# EAGLE design S7G7_footprint_simplified_w_ethernet_v1p14 (EAGLE 9.5.2)
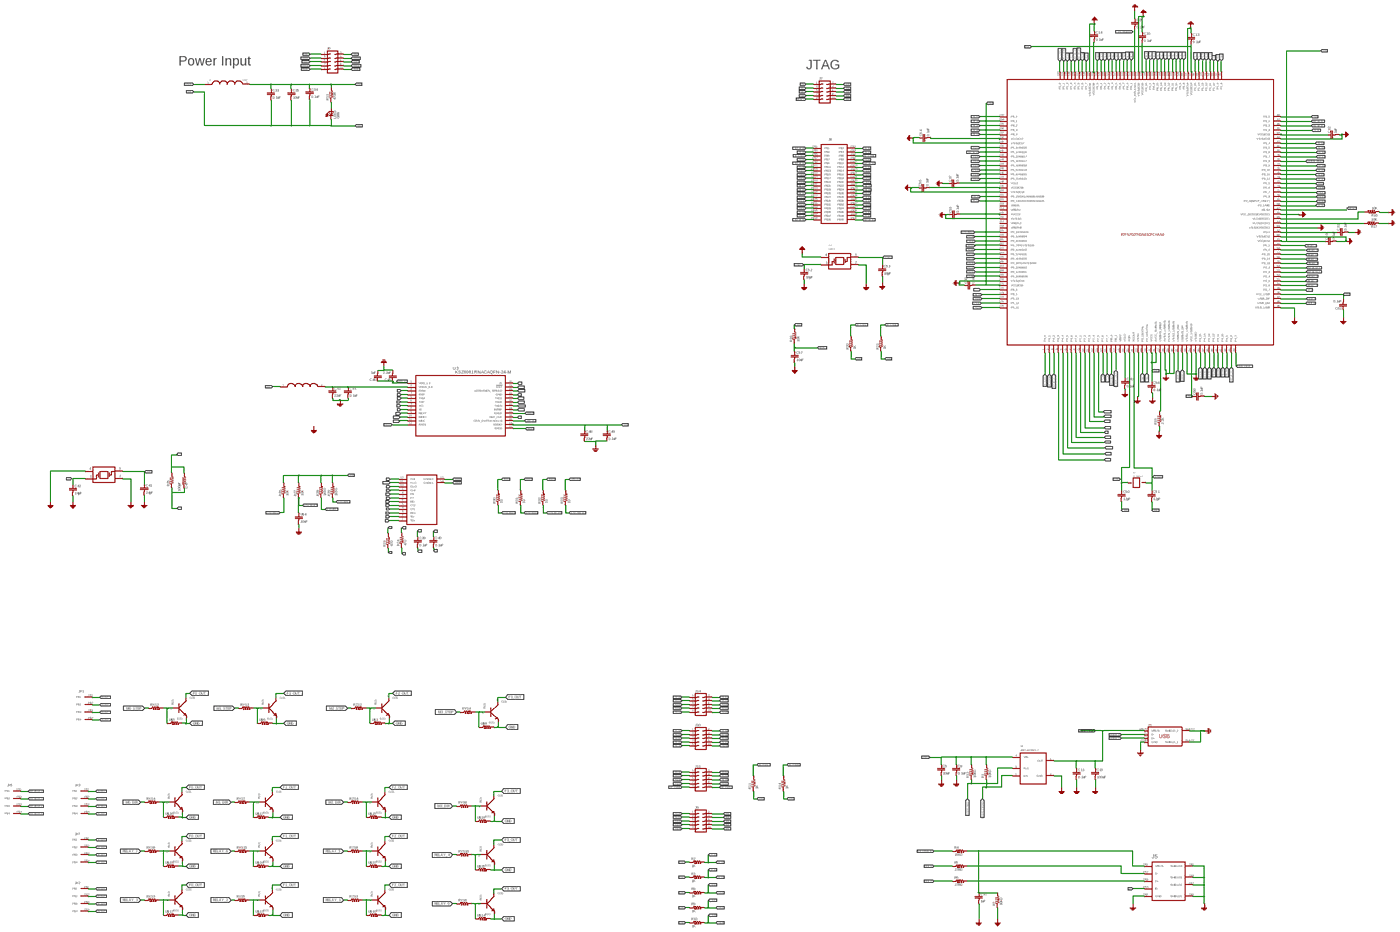
[diagram p0: schematic, sheet 1, overview]
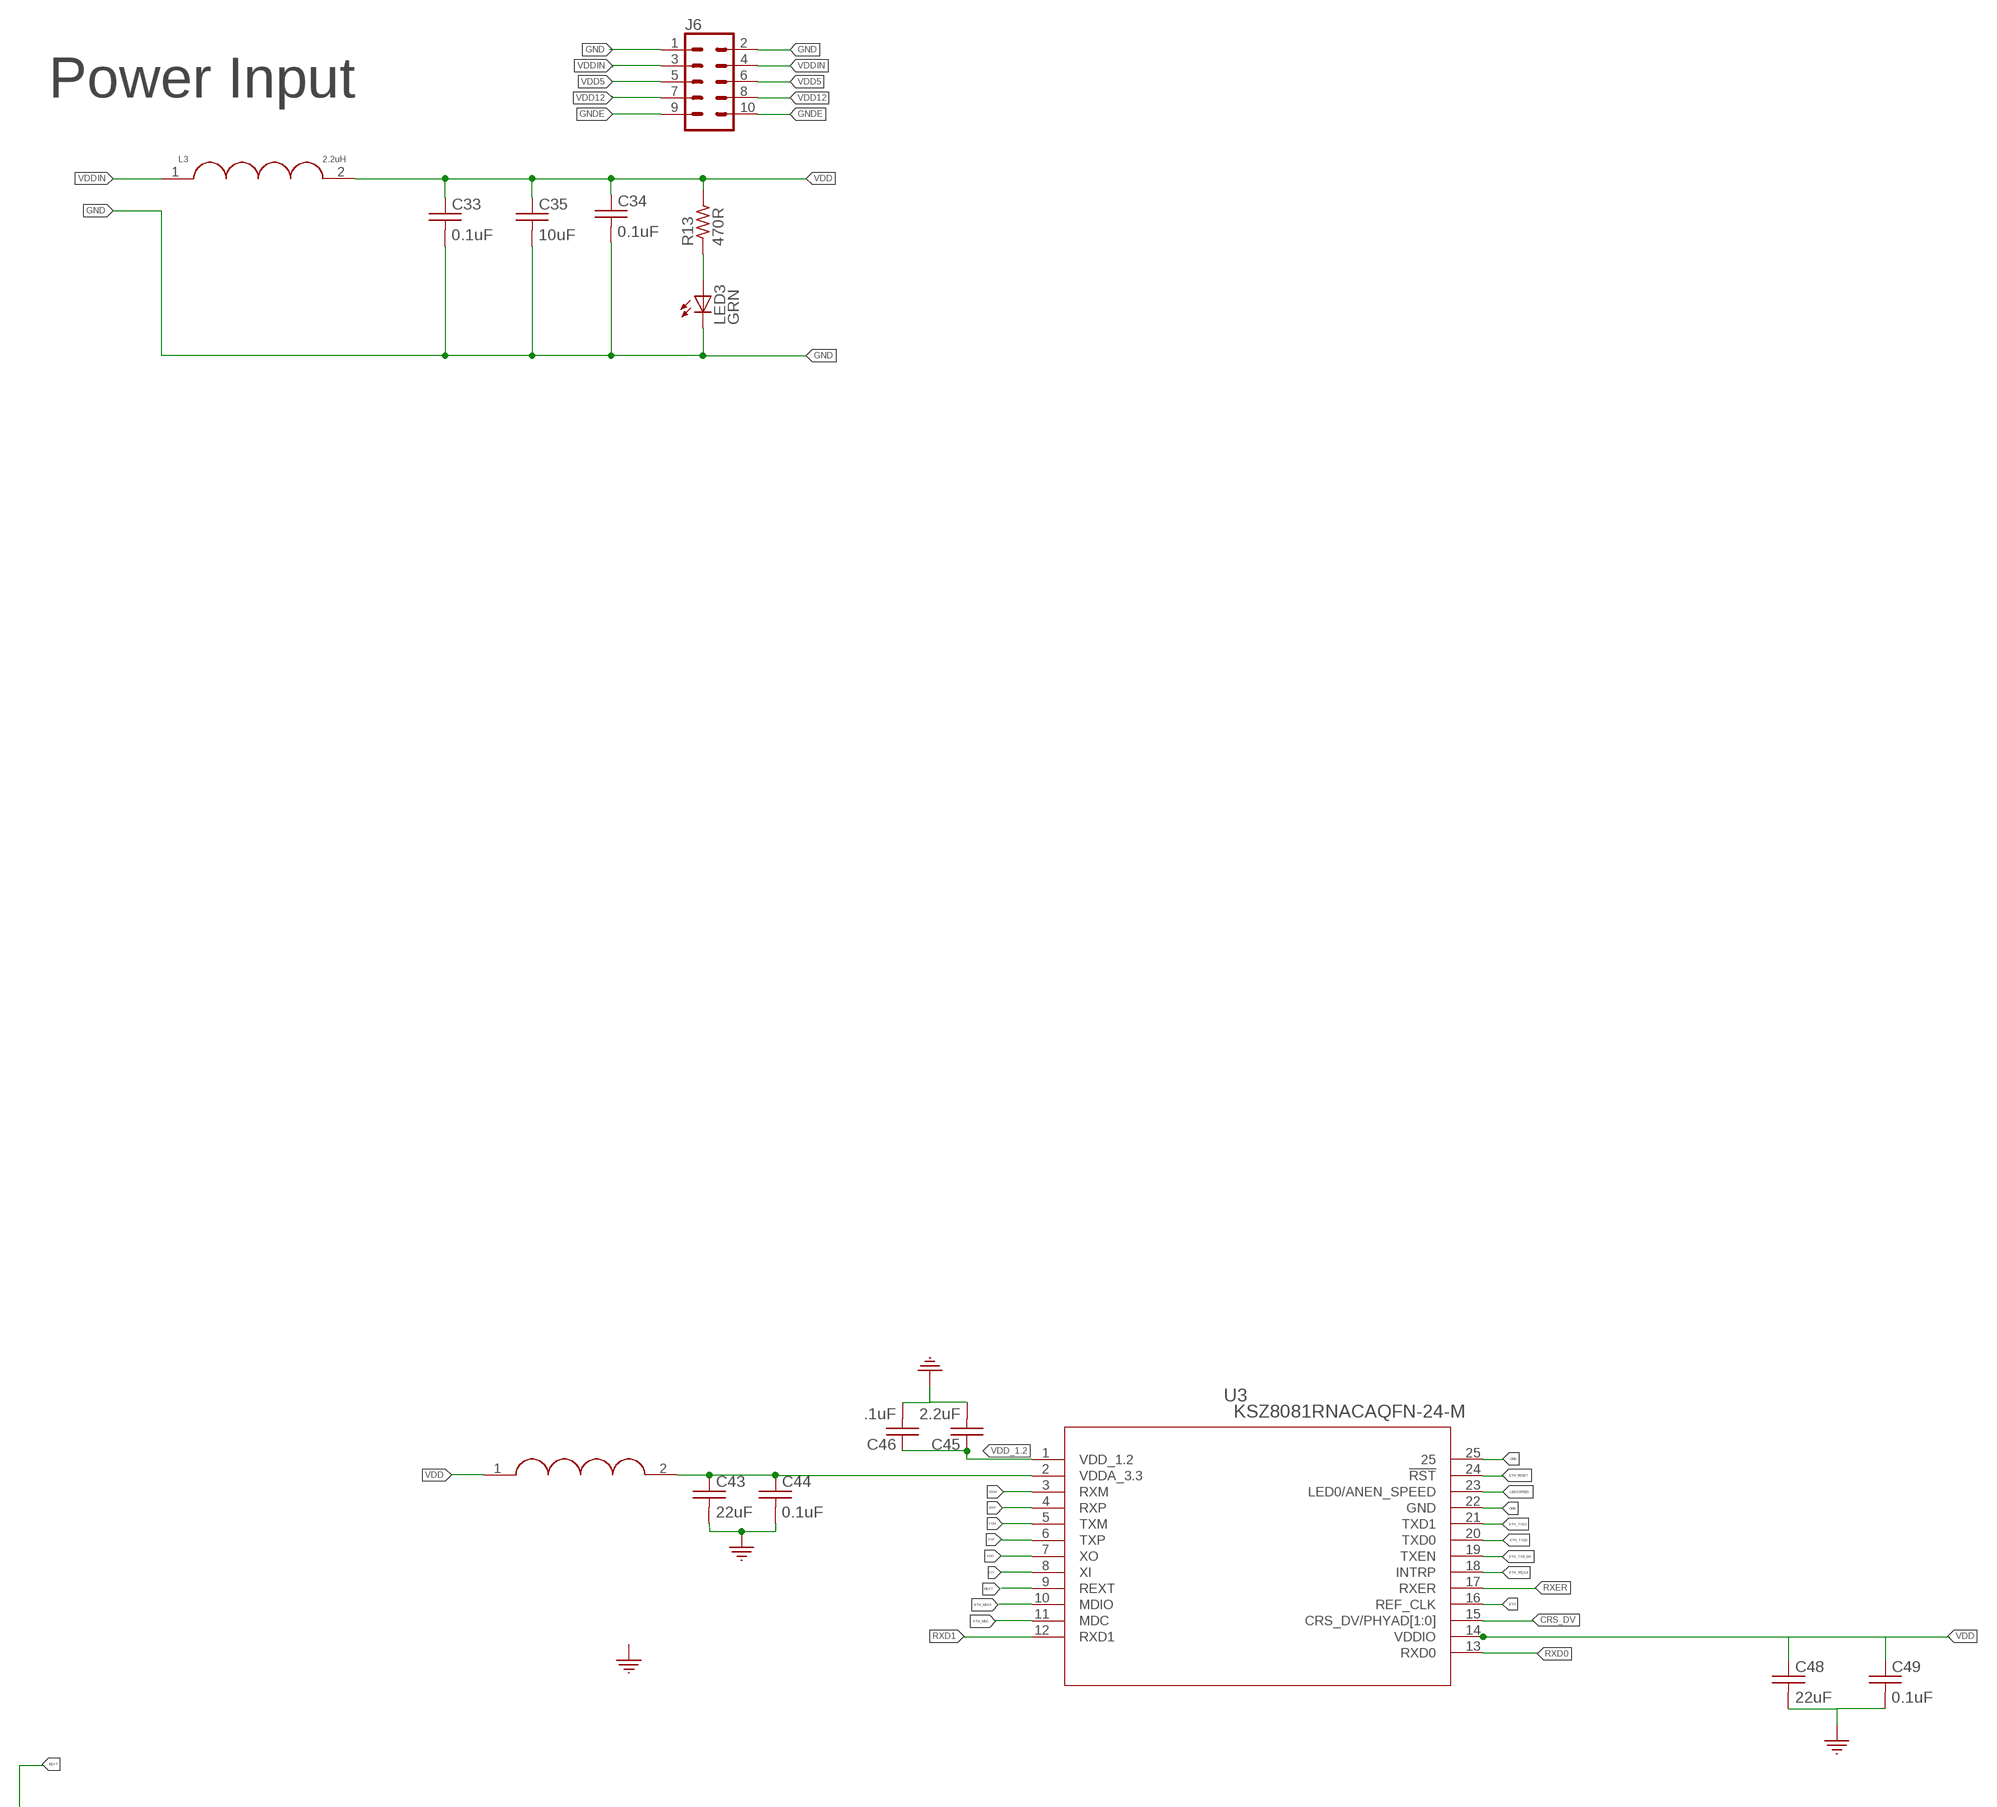
[diagram p1: schematic, sheet 1, part 1 of 4]
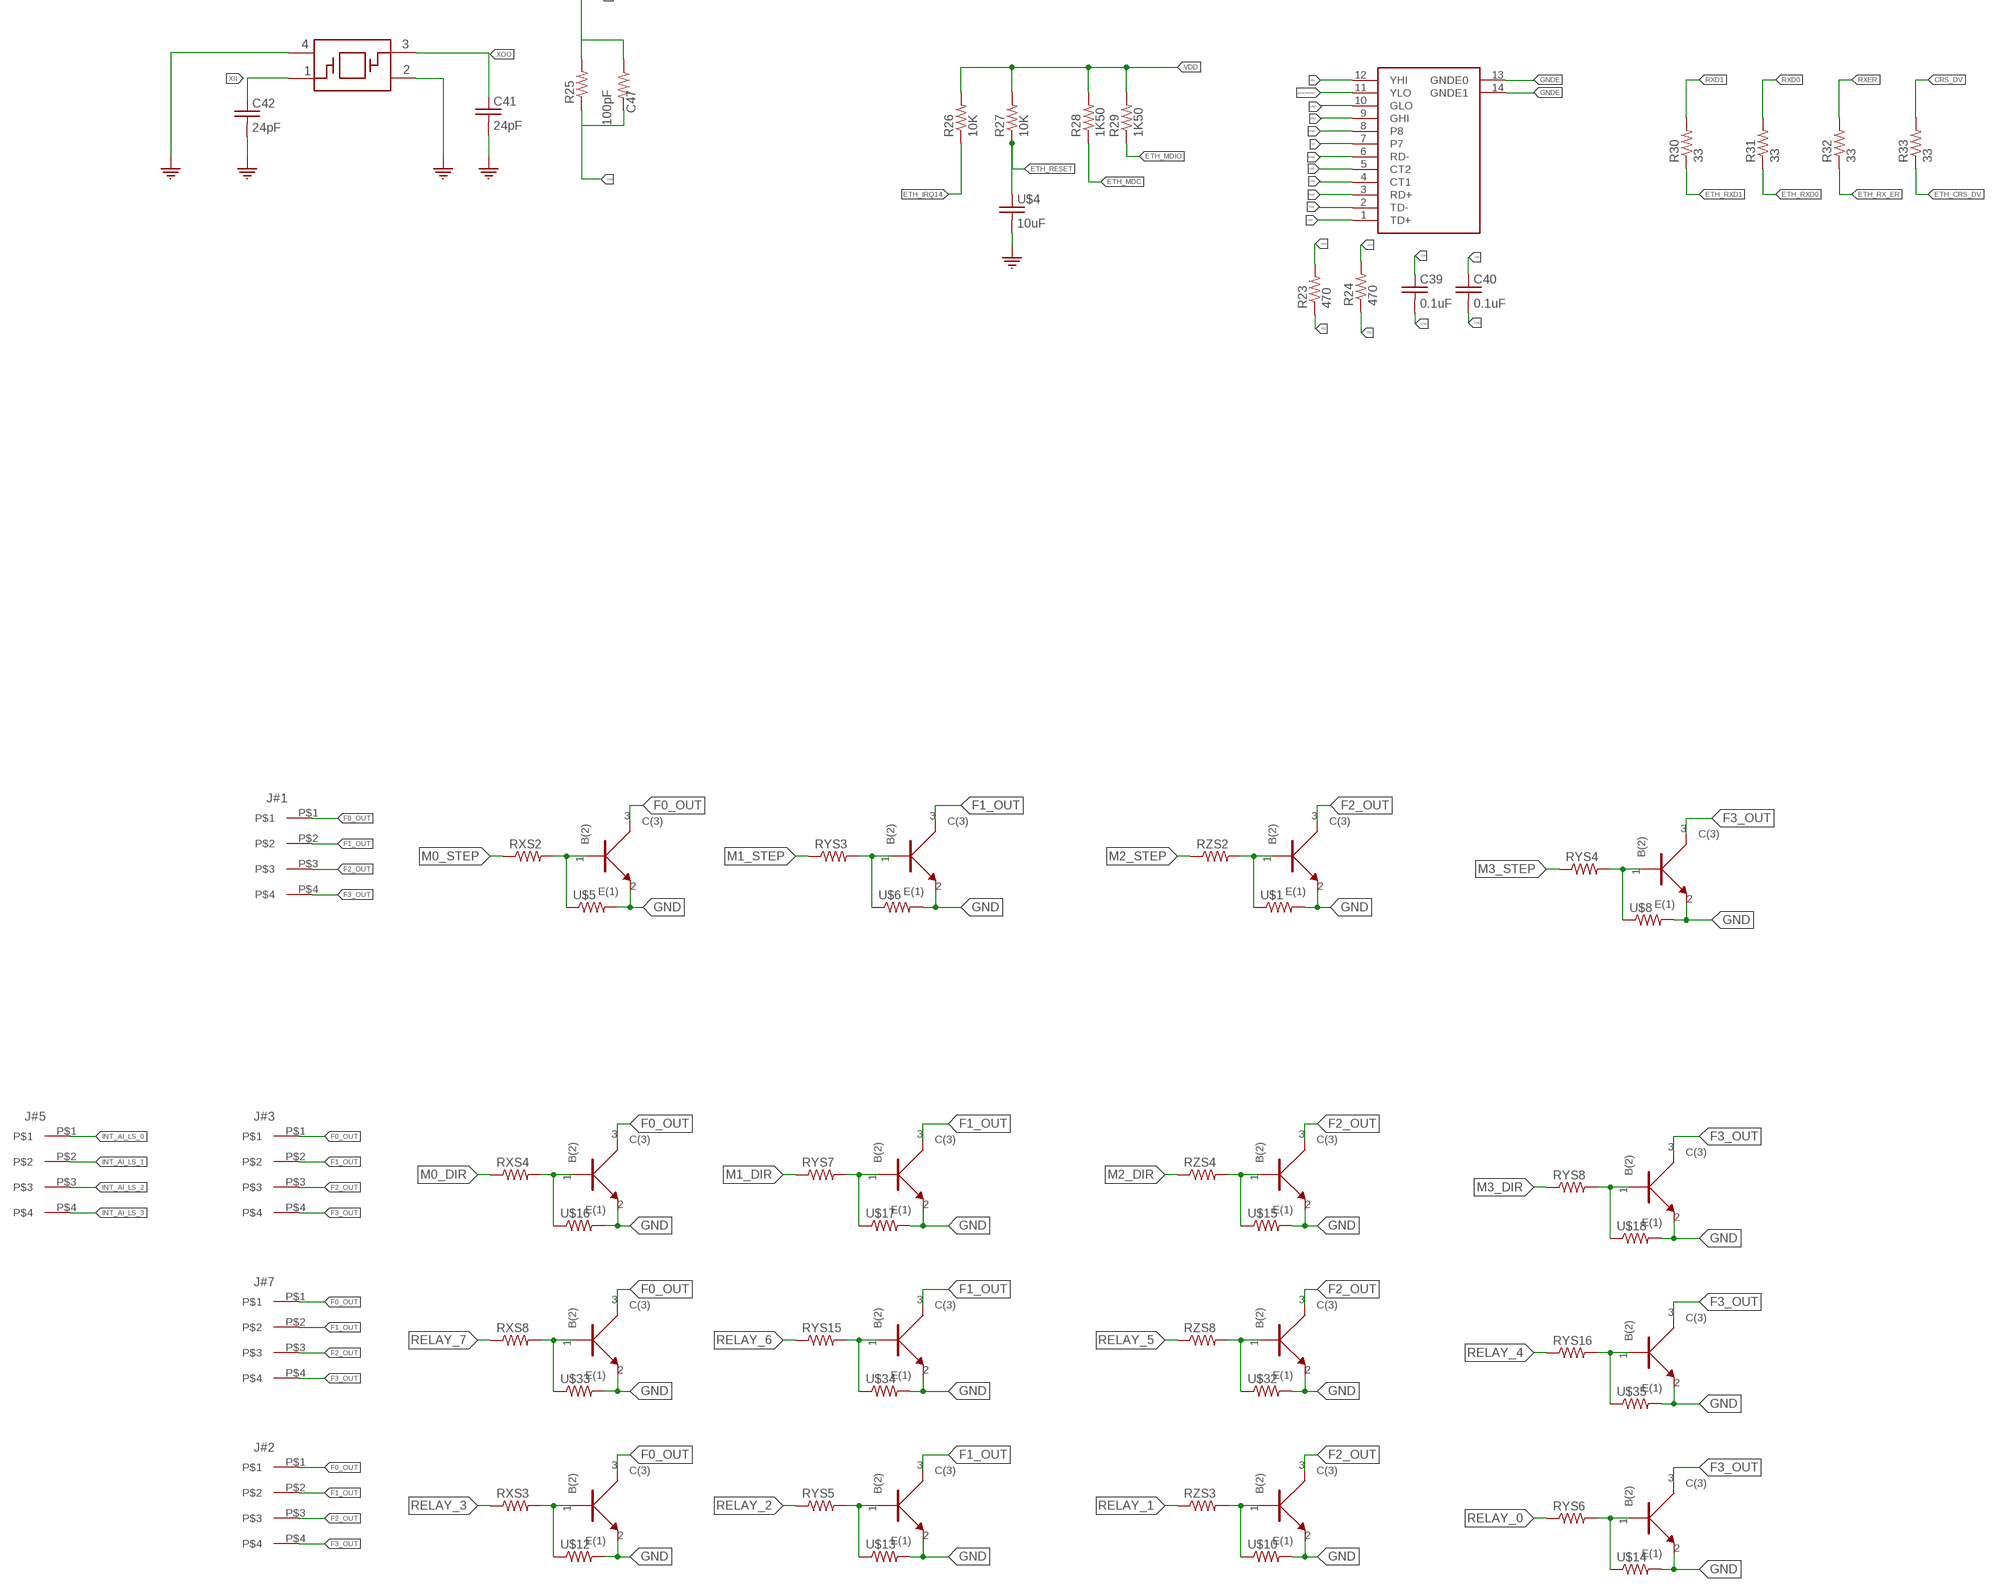
[diagram p2: schematic, sheet 1, part 2 of 4]
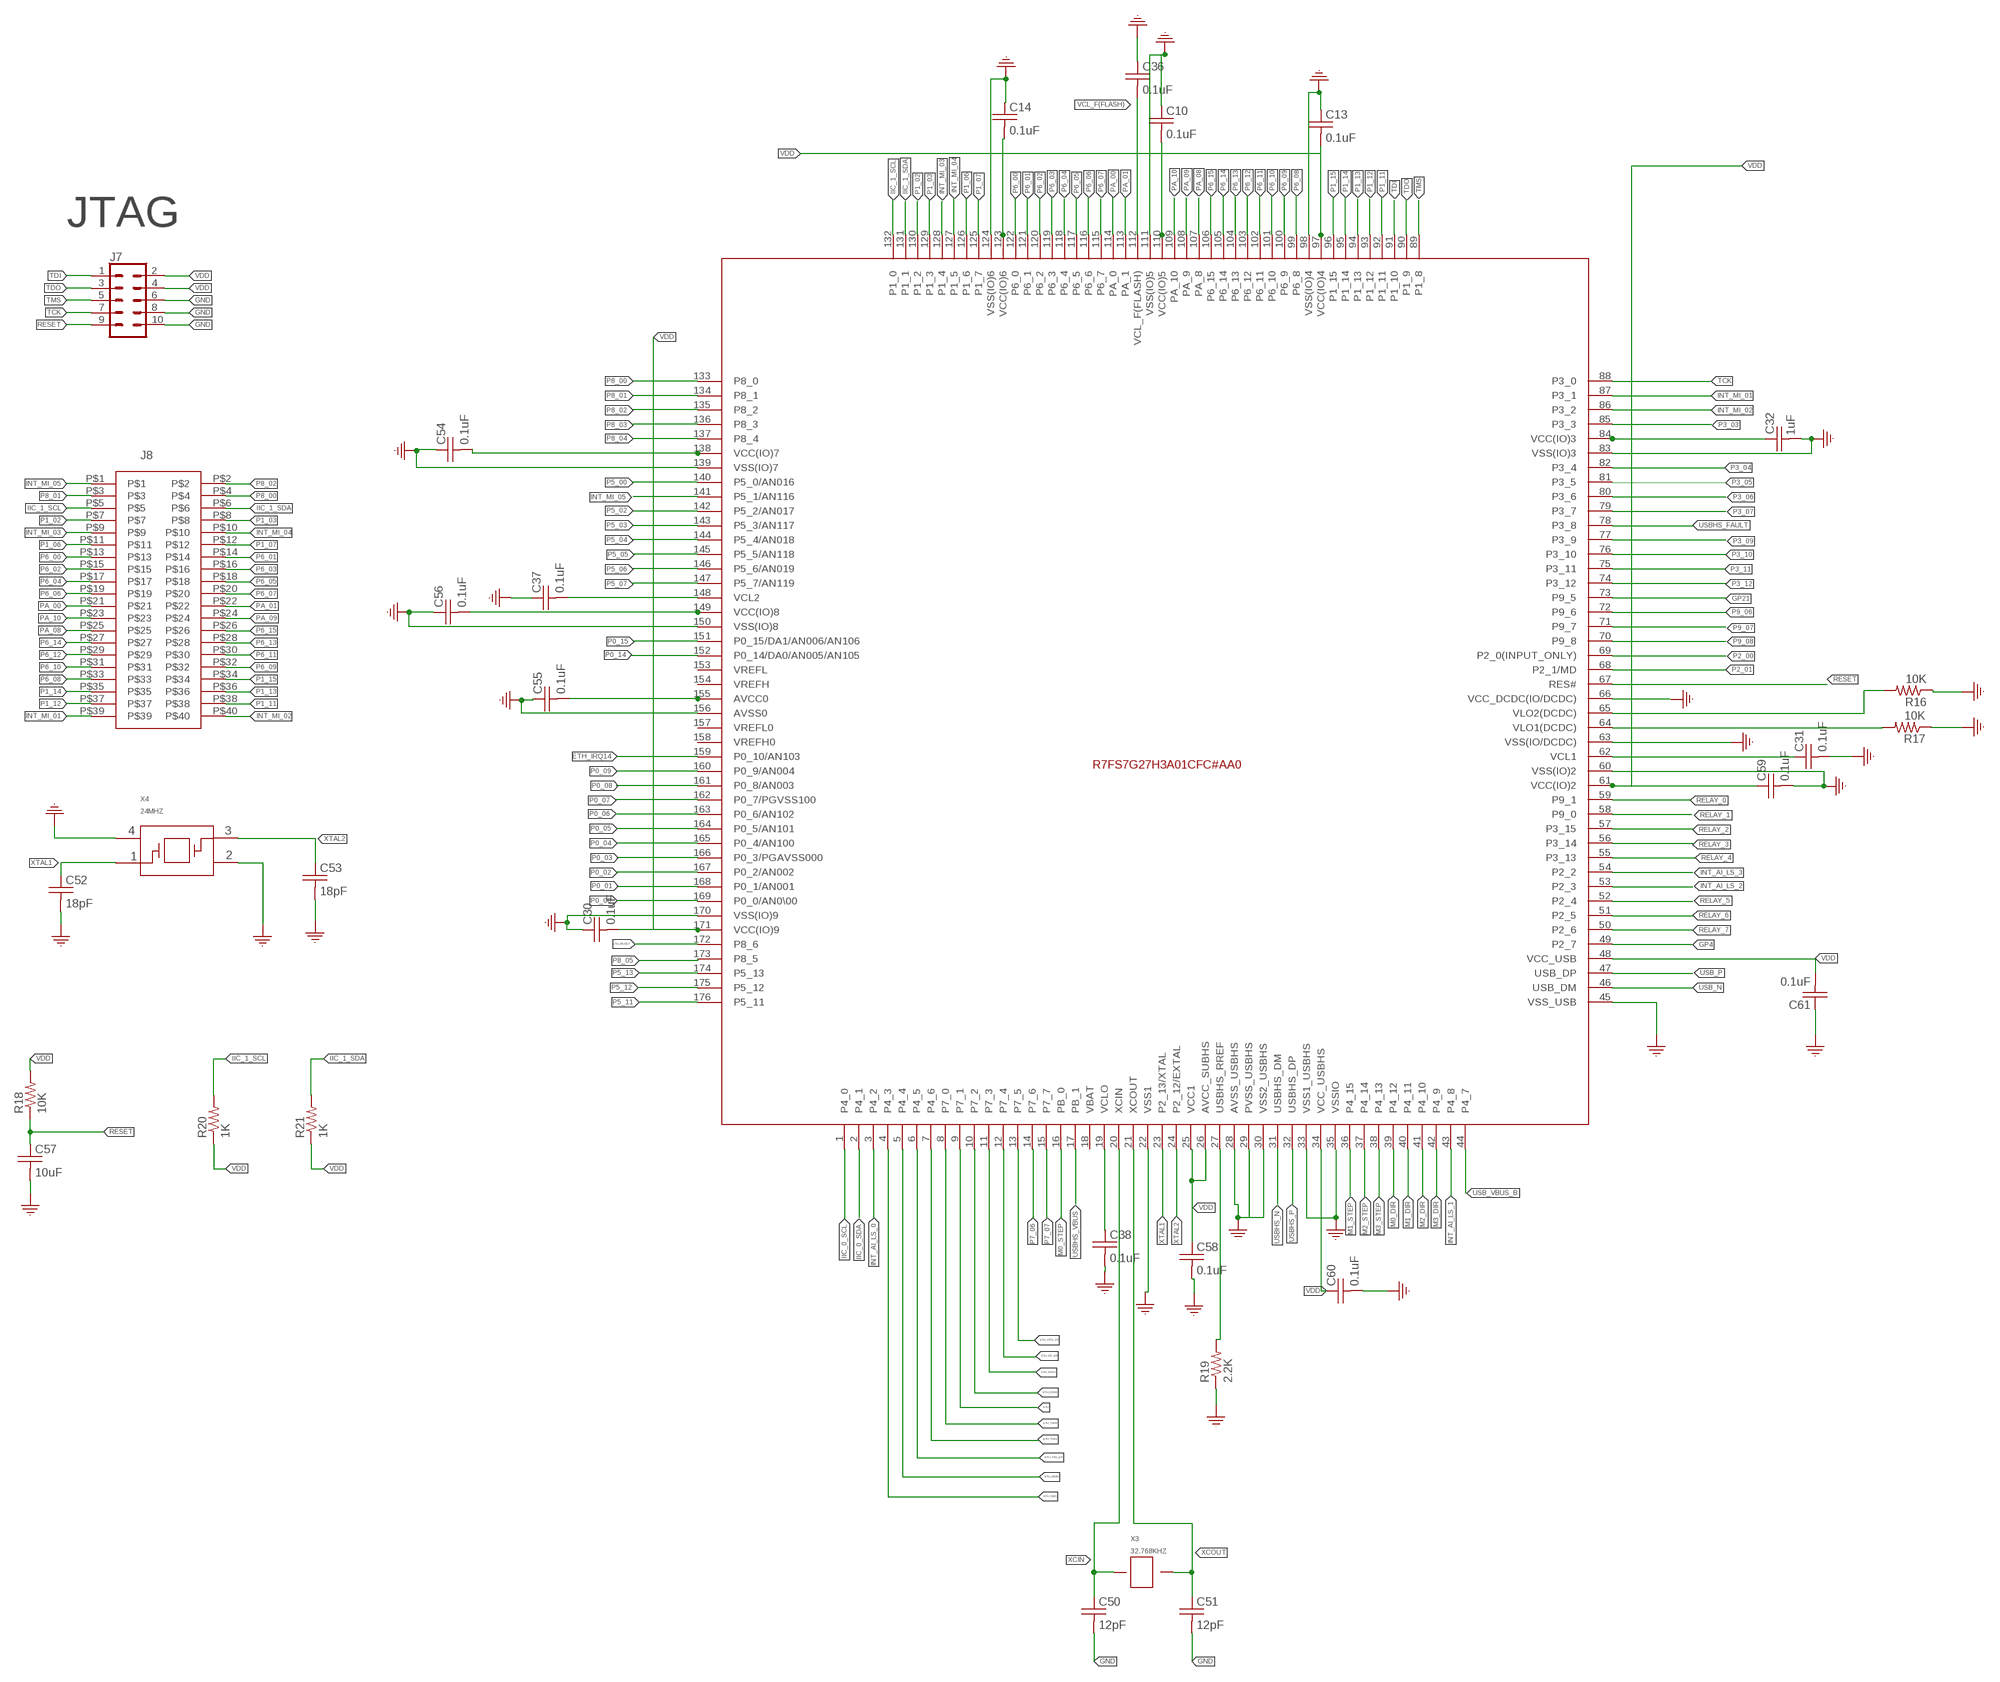
[diagram p3: schematic, sheet 1, part 3 of 4]
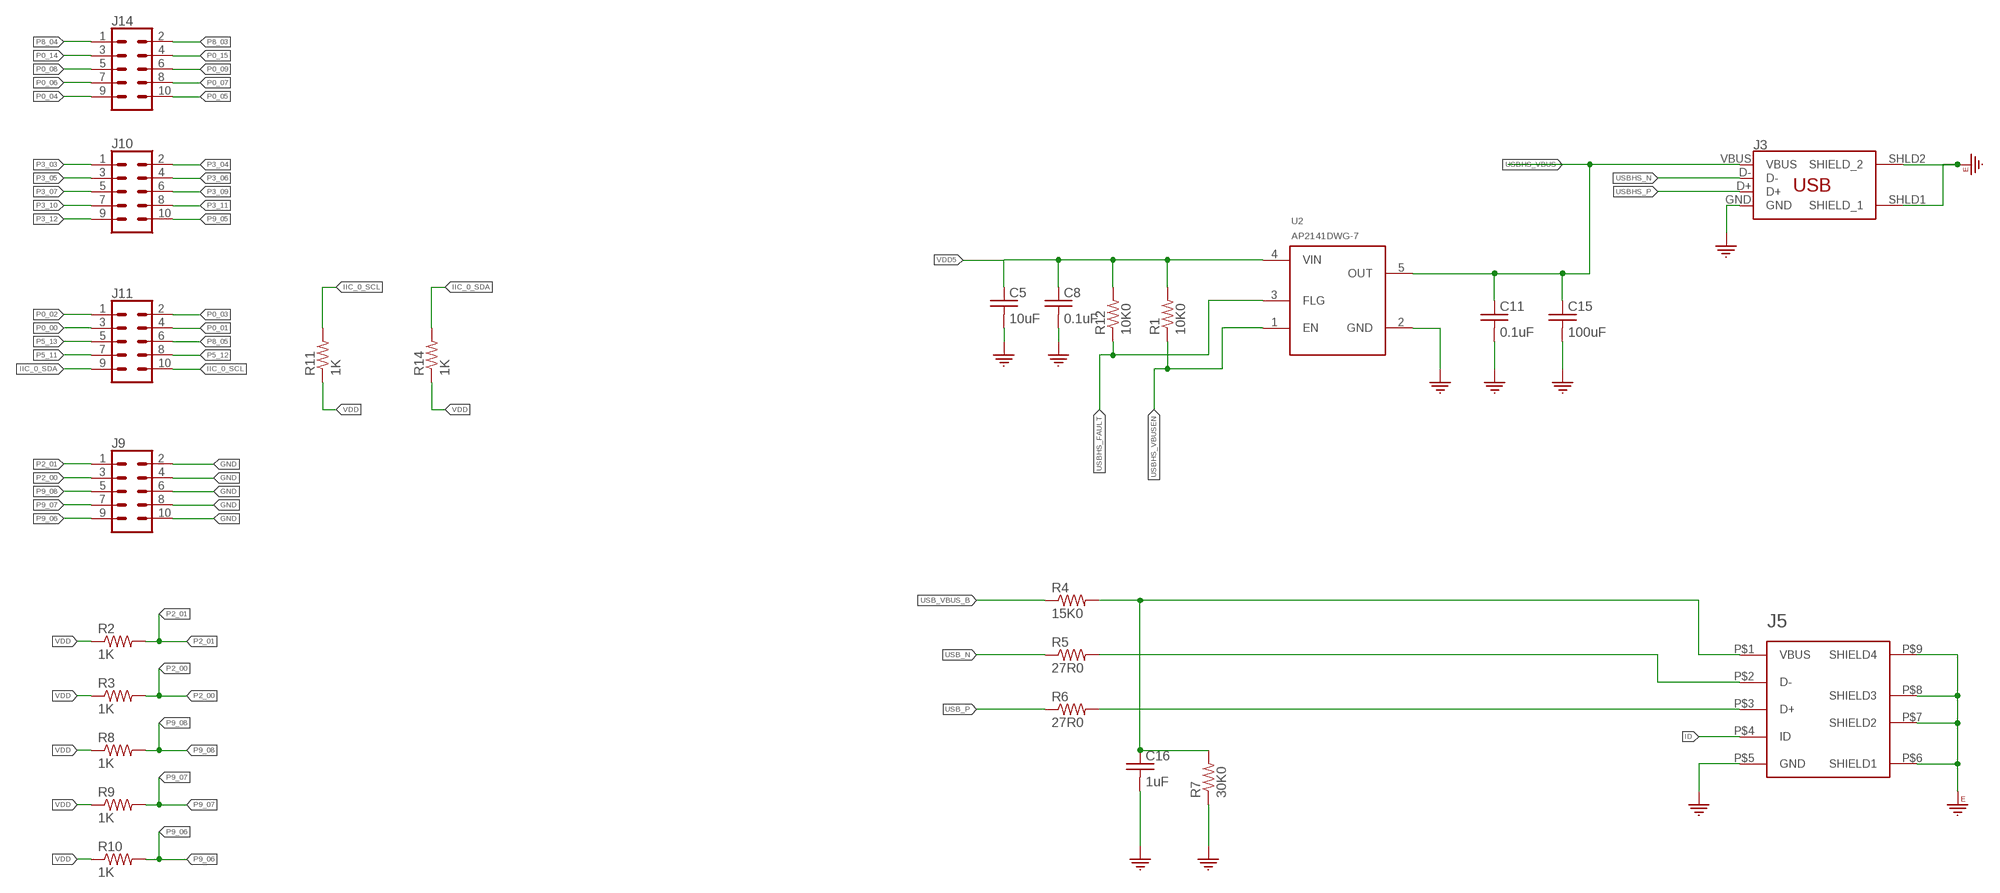
[diagram p4: schematic, sheet 1, part 4 of 4]

## Parts
C5  10uF  C_0402  [0402]
C8  0.1uF  C_0402  [0402]
C10  0.1uF  C_0402  [0402]
C11  0.1uF  C_0402  [0402]
C13  0.1uF  C_0402  [0402]
C14  0.1uF  C_0402  [0402]
C15  100uF  C_1210  [C1210]
C16  1uF  C_0402  [0402]
C30  0.1uF  C_0402  [0402]
C31  0.1uF  C_0402  [0402]
C32  1uF  C_0402  [0402]
C33  0.1uF  C_0402  [0402]
C34  0.1uF  C_0402  [0402]
C35  10uF  C_0402  [0402]
C36  0.1uF  C_0402  [0402]
C37  0.1uF  C_0402  [0402]
C38  0.1uF  C_0402  [0402]
C39  0.1uF  C_0402  [0402]
C40  0.1uF  C_0402  [0402]
C41  24pF  C_0402  [0402]
C42  24pF  C_0402  [0402]
C43  22uF  C_0603  [0603]
C44  0.1uF  C_0402  [0402]
C45  2.2uF  C_0402  [0402]
C46  .1uF  C_0402  [0402]
C47  100pF  R_0402  [0402]
C48  22uF  C_0603  [0603]
C49  0.1uF  C_0402  [0402]
C50  12pF  C_0402  [0402]
C51  12pF  C_0402  [0402]
C52  18pF  C_0402  [0402]
C53  18pF  C_0402  [0402]
C54  0.1uF  C_0402  [0402]
C55  0.1uF  C_0402  [0402]
C56  0.1uF  C_0402  [0402]
C57  10uF  C_0402  [0402]
C58  0.1uF  C_0402  [0402]
C59  0.1uF  C_0402  [0402]
C60  0.1uF  C_0402  [0402]
C61  0.1uF  C_0402  [0402]
FB2/2  FB_0805_120_OHM  [0805]
J3  USB_A  [USB_A_SMT]
J5  USB_MICRO-B  [USB_MICRO-B]
J6  CONN_05X2PTH  [2X5]
J7  CONN_05X2PTH  [2X5]
J8  HEADER_2_X_20_GENERIC  [HEADER_2_X_20_.1_INCH]
J9  CONN_05X2SHD_SMD  [2X5-SHROUDED_SMD]
J10  CONN_05X2NO_SILK  [2X5_NOSILK]
J11  CONN_05X2NO_SILK  [2X5_NOSILK]
J14  CONN_05X2NO_SILK  [2X5_NOSILK]
J#1  3.81MM_1_X_4_RT_ANGLE_PLUG_HEADER  [1X4_3.81MM_PITCH]
J#2  3.81MM_1_X_4_RT_ANGLE_PLUG_HEADER  [1X4_3.81MM_PITCH]
J#3  3.81MM_1_X_4_RT_ANGLE_PLUG_HEADER  [1X4_3.81MM_PITCH]
J#5  3.81MM_1_X_4_RT_ANGLE_PLUG_HEADER  [1X4_3.81MM_PITCH]
J#7  3.81MM_1_X_4_RT_ANGLE_PLUG_HEADER  [1X4_3.81MM_PITCH]
L3  2.2uH  INDUCTOR_1008_2.2_MH_1.3A  [1008_(2520_METRIC)]
LED3  LED_0805_GREEN  [LED_0805_GREEN]
R1  10K0  R_0402  [0402]
R2  1K  R_0402  [0402]
R3  1K  R_0402  [0402]
R4  15K0  R_0402  [0402]
R5  27R0  R_0402  [0402]
R6  27R0  R_0402  [0402]
R7  30K0  R_0402  [0402]
R8  1K  R_0402  [0402]
R9  1K  R_0402  [0402]
R10  1K  R_0402  [0402]
R11  1K  R_0402  [0402]
R12  10K0  R_0402  [0402]
R13  470R  R_0402  [0402]
R14  1K  R_0402  [0402]
R16  10K  R_0402  [0402]
R17  10K  R_0402  [0402]
R18  10K  R_0402  [0402]
R19  2.2K  R_0402  [0402]
R20  1K  R_0402  [0402]
R21  1K  R_0402  [0402]
R23  470  R_0402  [0402]
R24  470  R_0402  [0402]
R25  6k49  R_0402  [0402]
R26  10K  R_0402  [0402]
R27  10K  R_0402  [0402]
R28  1K50  R_0402  [0402]
R29  1K50  R_0402  [0402]
R30  33  R_0402  [0402]
R31  33  R_0402  [0402]
R32  33  R_0402  [0402]
R33  33  R_0402  [0402]
RXS2  R_0402  [0402]
RXS3  R_0402  [0402]
RXS4  R_0402  [0402]
RXS8  R_0402  [0402]
RYS3  R_0402  [0402]
RYS4  R_0402  [0402]
RYS5  R_0402  [0402]
RYS6  R_0402  [0402]
RYS7  R_0402  [0402]
RYS8  R_0402  [0402]
RYS15  R_0402  [0402]
RYS16  R_0402  [0402]
RZS2  R_0402  [0402]
RZS3  R_0402  [0402]
RZS4  R_0402  [0402]
RZS8  R_0402  [0402]
U2  AP2141DWG-5  [SOT-23-5]
U3  KSZ8081RNACAQFN-24-M  [QFN-24-M]
U4  S7G2_X_176  [LQFP176_24X24]
U7  BC846BW  [SOT323]
U8  BC846BW  [SOT323]
U9  BC846BW  [SOT323]
U10  BC846BW  [SOT323]
U12  BC846BW  [SOT323]
U13  BC846BW  [SOT323]
U14  BC846BW  [SOT323]
U15  BC846BW  [SOT323]
U16  BC846BW  [SOT323]
U17  BC846BW  [SOT323]
U18  BC846BW  [SOT323]
U19  BC846BW  [SOT323]
U32  BC846BW  [SOT323]
U33  BC846BW  [SOT323]
U34  BC846BW  [SOT323]
U35  BC846BW  [SOT323]
U$1  R_0402  [0402]
U$2  RJ45_WITH_ELEC  [RJ45_TH_ELEC]
U$3  XTAL_25_MHZ  [SMD_3225]
U$4  10uF  C_0402  [0402]
U$5  R_0402  [0402]
U$6  R_0402  [0402]
U$8  R_0402  [0402]
U$10  R_0402  [0402]
U$12  R_0402  [0402]
U$13  R_0402  [0402]
U$14  R_0402  [0402]
U$15  R_0402  [0402]
U$16  R_0402  [0402]
U$17  R_0402  [0402]
U$18  R_0402  [0402]
U$32  R_0402  [0402]
U$33  R_0402  [0402]
U$34  R_0402  [0402]
U$35  R_0402  [0402]
X3  32.768KHZ  XTAL_32.768KHZ  [SMD_X_2_PADS]
X4  24MHZ  XTAL_24_MHZ  [SMD_3225]

## Nets
C58: C39.P$1 U$2.4(CT1)
C60: C40.P$1 U$2.5(CT2)
CRS_DV: R33.P$2 U3.15(CRS_DV/PHYAD[1:0])
D+: J5.P$3(D+) R6.P$2
D-: J5.P$2(D-) R5.P$2
ETH: U3.16(REF_CLK) U4.9(P7_1)
ETH_CRS_DV: R33.P$1 U4.13(P7_5)
ETH_IRQ14: R26.P$1 U3.18(INTRP) U4.159(P0_10/AN103)
ETH_MDC: R28.P$1 U3.11(MDC) U4.4(P4_3)
ETH_MDIO: R29.P$1 U3.10(MDIO) U4.5(P4_4)
ETH_RESET: R27.P$1 U3.24(!RST) U4.172(P8_6) U$4.P$1
ETH_RX_ER: R32.P$1 U4.12(P7_4)
ETH_RXD0: R31.P$1 U4.10(P7_2)
ETH_RXD1: R30.P$1 U4.11(P7_3)
ETH_TXD0: U3.20(TXD0) U4.8(P7_0)
ETH_TXD1: U3.21(TXD1) U4.7(P4_6)
ETH_TXD_EN: U3.19(TXEN) U4.6(P4_5)
F0_OUT: J#1.P$1 J#2.P$1 J#3.P$1 J#7.P$1 U8.3(C(3)) U13.3(C(3)) U17.3(C(3)) U33.3(C(3))
F1_OUT: J#1.P$2 J#2.P$2 J#3.P$2 J#7.P$2 U9.3(C(3)) U14.3(C(3)) U18.3(C(3)) U34.3(C(3))
F2_OUT: J#1.P$3 J#2.P$3 J#3.P$3 J#7.P$3 U7.3(C(3)) U12.3(C(3)) U16.3(C(3)) U32.3(C(3))
F3_OUT: J#1.P$4 J#2.P$4 J#3.P$4 J#7.P$4 U10.3(C(3)) U15.3(C(3)) U19.3(C(3)) U35.3(C(3))
GND: C5.P$2 C8.P$2 C10.P$1 C11.P$2 C13.P$1 C14.P$1 C15.2 C16.P$2 C30.P$1 C31.P$2 C32.P$2 C33.P$2 C34.P$2 C35.P$2 C36.P$1 C37.P$1 C38.P$2 C39.P$2 C40.P$2 C41.P$2 C42.P$2 C43.2 C44.P$2 C45.P$2 C46.P$2 C47.P$2 C48.2 C49.P$2 C50.P$2 C51.P$2 C52.P$2 C53.P$2 C54.P$1 C55.P$1 C56.P$1 C57.P$2 C58.P$2 C59.P$2 C60.P$2 C61.P$1 J3.GND J5.P$5(GND) J6.1 J6.2 J7.6 J7.8 J7.10 J9.2 J9.4 J9.6 J9.8 J9.10 LED3.C R7.P$1 R16.P$1 R17.P$1 R19.P$1 R25.P$1 U2.2(GND) U3.22(GND) U3.25 U4.22(VSS1) U4.28(AVSS_USBHS) U4.29(PVSS_USBHS) U4.30(VSS2_USBHS) U4.33(VSS1_USBHS) U4.35(VSSIO) U4.45(VSS_USB) U4.60(VSS(IO)2) U4.63(VSS(IO/DCDC)) U4.66(VCC_DCDC(IO/DCDC)) U4.83(VSS(IO)3) U4.98(VSS(IO)4) U4.111(VSS(IO)5) U4.124(VSS(IO)6) U4.139(VSS(IO)7) U4.150(VSS(IO)8) U4.156(AVSS0) U4.170(VSS(IO)9) U7.2(E(1)) U8.2(E(1)) U9.2(E(1)) U10.2(E(1)) U12.2(E(1)) U13.2(E(1)) U14.2(E(1)) U15.2(E(1)) U16.2(E(1)) U17.2(E(1)) U18.2(E(1)) U19.2(E(1)) U32.2(E(1)) U33.2(E(1)) U34.2(E(1)) U35.2(E(1)) U$1.P$2 U$2.8 U$2.10(GLO) U$3.2 U$3.4 U$4.P$2 U$5.P$2 U$6.P$2 U$8.P$2 U$10.P$2 U$12.P$2 U$13.P$2 U$14.P$2 U$15.P$2 U$16.P$2 U$17.P$2 U$18.P$2 U$32.P$2 U$33.P$2 U$34.P$2 U$35.P$2 X4.2 X4.4
GNDE: J3.SHLD1(SHIELD_1) J3.SHLD2(SHIELD_2) J5.P$6(SHIELD1) J5.P$7(SHIELD2) J5.P$8(SHIELD3) J5.P$9(SHIELD4) J6.9 J6.10 U$2.13(GNDE0) U$2.14(GNDE1)
GP4: U4.49(P2_7)
GP21: U4.73(P9_5)
ID: J5.P$4(ID)
IIC_0_SCL: J11.10 R11.P$2 U4.1(P4_0)
IIC_0_SDA: J11.9 R14.P$2 U4.2(P4_1)
IIC_1_SCL: J8.P$5 R20.P$2 U4.132(P1_0)
IIC_1_SDA: J8.P$6 R21.P$2 U4.131(P1_1)
INT_AI_LS_0: J#5.P$1 U4.3(P4_2)
INT_AI_LS_1: J#5.P$2 U4.43(P4_8)
INT_AI_LS_2: J#5.P$3 U4.53(P2_3)
INT_AI_LS_3: J#5.P$4 U4.54(P2_2)
INT_MI_01: J8.P$39 U4.87(P3_1)
INT_MI_02: J8.P$40 U4.86(P3_2)
INT_MI_03: J8.P$9 U4.128(P1_4)
INT_MI_04: J8.P$10 U4.127(P1_5)
INT_MI_05: J8.P$1 U4.141(P5_1/AN116)
LED1/SPEED: U3.23(LED0/ANEN_SPEED) U$2.11(YLO)
M0_DIR: RXS4.P$1 U4.39(P4_12)
M0_STEP: RXS2.P$1 U4.16(PB_0)
M1_DIR: RYS7.P$1 U4.40(P4_11)
M1_STEP: RYS3.P$1 U4.36(P4_15)
M2_DIR: RZS4.P$1 U4.41(P4_10)
M2_STEP: RZS2.P$1 U4.37(P4_14)
M3_DIR: RYS8.P$1 U4.42(P4_9)
M3_STEP: RYS4.P$1 U4.38(P4_13)
N$1: C37.P$2 U4.148(VCL2)
N$3: LED3.A R13.P$1
N$4: C38.P$1 U4.19(VCLO)
N$5: C31.P$1 U4.62(VCL1)
N$6: R17.P$2 U4.64(VLO1(DCDC))
N$7: R16.P$2 U4.65(VLO2(DCDC))
N$8: R19.P$2 U4.27(USBHS_RREF)
N$11: RZS2.P$2 U7.1(B(2)) U$1.P$1
N$12: RXS2.P$2 U8.1(B(2)) U$5.P$1
N$13: RYS3.P$2 U9.1(B(2)) U$6.P$1
N$14: RYS4.P$2 U10.1(B(2)) U$8.P$1
N$15: RZS3.P$2 U12.1(B(2)) U$10.P$1
N$16: RXS3.P$2 U13.1(B(2)) U$12.P$1
N$17: RYS5.P$2 U14.1(B(2)) U$13.P$1
N$18: RYS6.P$2 U15.1(B(2)) U$14.P$1
N$19: RZS4.P$2 U16.1(B(2)) U$15.P$1
N$20: RXS4.P$2 U17.1(B(2)) U$16.P$1
N$22: RYS7.P$2 U18.1(B(2)) U$17.P$1
N$23: RYS8.P$2 U19.1(B(2)) U$18.P$1
N$36: RZS8.P$2 U32.1(B(2)) U$32.P$1
N$37: RXS8.P$2 U33.1(B(2)) U$33.P$1
N$38: RYS15.P$2 U34.1(B(2)) U$34.P$1
N$39: RYS16.P$2 U35.1(B(2)) U$35.P$1
NC: U$2.7
P0_00: J11.3 U4.169(P0_0/AN0\00)
P0_01: J11.4 U4.168(P0_1/AN001)
P0_02: J11.1 U4.167(P0_2/AN002)
P0_03: J11.2 U4.166(P0_3/PGAVSS000)
P0_04: J14.9 U4.165(P0_4/AN100)
P0_05: J14.10 U4.164(P0_5/AN101)
P0_06: J14.7 U4.163(P0_6/AN102)
P0_07: J14.8 U4.162(P0_7/PGVSS100)
P0_08: J14.5 U4.161(P0_8/AN003)
P0_09: J14.6 U4.160(P0_9/AN004)
P0_14: J14.3 U4.152(P0_14/DA0/AN005/AN105)
P0_15: J14.4 U4.151(P0_15/DA1/AN006/AN106)
P1_02: J8.P$7 U4.130(P1_2)
P1_03: J8.P$8 U4.129(P1_3)
P1_06: J8.P$11 U4.126(P1_6)
P1_07: J8.P$12 U4.125(P1_7)
P1_11: J8.P$38 U4.92(P1_11)
P1_12: J8.P$37 U4.93(P1_12)
P1_13: J8.P$36 U4.94(P1_13)
P1_14: J8.P$35 U4.95(P1_14)
P1_15: J8.P$34 U4.96(P1_15)
P2_00: J9.3 R3.P$2 U4.69(P2_0(INPUT_ONLY))
P2_01: J9.1 R2.P$2 U4.68(P2_1/MD)
P3_03: J10.1 U4.85(P3_3)
P3_04: J10.2 U4.82(P3_4)
P3_05: J10.3 U4.81(P3_5)
P3_06: J10.4 U4.80(P3_6)
P3_07: J10.5 U4.79(P3_7)
P3_09: J10.6 U4.77(P3_9)
P3_10: J10.7 U4.76(P3_10)
P3_11: J10.8 U4.75(P3_11)
P3_12: J10.9 U4.74(P3_12)
P5_00: U4.140(P5_0/AN016)
P5_02: U4.142(P5_2/AN017)
P5_03: U4.143(P5_3/AN117)
P5_04: U4.144(P5_4/AN018)
P5_05: U4.145(P5_5/AN118)
P5_06: U4.146(P5_6/AN019)
P5_07: U4.147(P5_7/AN119)
P5_11: J11.7 U4.176(P5_11)
P5_12: J11.8 U4.175(P5_12)
P5_13: J11.5 U4.174(P5_13)
P6_00: J8.P$13 U4.122(P6_0)
P6_01: J8.P$14 U4.121(P6_1)
P6_02: J8.P$15 U4.120(P6_2)
P6_03: J8.P$16 U4.119(P6_3)
P6_04: J8.P$17 U4.118(P6_4)
P6_05: J8.P$18 U4.117(P6_5)
P6_06: J8.P$19 U4.116(P6_6)
P6_07: J8.P$20 U4.115(P6_7)
P6_08: J8.P$33 U4.99(P6_8)
P6_09: J8.P$32 U4.100(P6_9)
P6_10: J8.P$31 U4.101(P6_10)
P6_11: J8.P$30 U4.102(P6_11)
P6_12: J8.P$29 U4.103(P6_12)
P6_13: J8.P$28 U4.104(P6_13)
P6_14: J8.P$27 U4.105(P6_14)
P6_15: J8.P$26 U4.106(P6_15)
P7_06: U4.14(P7_6)
P7_07: U4.15(P7_7)
P8_00: J8.P$4 U4.133(P8_0)
P8_01: J8.P$3 U4.134(P8_1)
P8_02: J8.P$2 U4.135(P8_2)
P8_03: J14.2 U4.136(P8_3)
P8_04: J14.1 U4.137(P8_4)
P8_05: J11.6 U4.173(P8_5)
P9_05: J10.10
P9_06: J9.9 R10.P$2 U4.72(P9_6)
P9_07: J9.7 R9.P$2 U4.71(P9_7)
P9_08: J9.5 R8.P$2 U4.70(P9_8)
PA_00: J8.P$21 U4.114(PA_0)
PA_01: J8.P$22 U4.113(PA_1)
PA_08: J8.P$25 U4.107(PA_8)
PA_09: J8.P$24 U4.108(PA_9)
PA_10: J8.P$23 U4.109(PA_10)
R51: R23.P$1 U$2.12(YHI)
R52: R24.P$1 U$2.9(GHI)
RELAY_0: RYS6.P$1 U4.59(P9_1)
RELAY_1: RZS3.P$1 U4.58(P9_0)
RELAY_2: RYS5.P$1 U4.57(P3_15)
RELAY_3: RXS3.P$1 U4.56(P3_14)
RELAY_4: RYS16.P$1 U4.55(P3_13)
RELAY_5: RZS8.P$1 U4.52(P2_4)
RELAY_6: RYS15.P$1 U4.51(P2_5)
RELAY_7: RXS8.P$1 U4.50(P2_6)
RESET: C57.P$1 J7.9 R18.P$1 U4.67(RES#)
REXT: C47.P$1 R25.P$2 U3.9(REXT)
RXD0: R31.P$2 U3.13(RXD0)
RXD1: R30.P$2 U3.12(RXD1)
RXER: R32.P$2 U3.17(RXER)
RXM: U3.3(RXM) U$2.6(RD-)
RXP: U3.4(RXP) U$2.3(RD+)
TCK: J7.7 U4.88(P3_0)
TDI: J7.1 U4.91(P1_10)
TDO: J7.3 U4.90(P1_9)
TMS: J7.5 U4.89(P1_8)
TXM: U3.5(TXM) U$2.2(TD-)
TXP: U3.6(TXP) U$2.1(TD+)
USB_N: R5.P$1 U4.46(USB_DM)
USB_P: R6.P$1 U4.47(USB_DP)
USB_VBUS_B: R4.P$1 U4.44(P4_7)
USBHS_FAULT: R12.P$1 U2.3(FLG) U4.78(P3_8)
USBHS_N: J3.D- U4.31(USBHS_DM)
USBHS_P: J3.D+ U4.32(USBHS_DP)
USBHS_VBUS: C11.P$1 C15.1 J3.VBUS U2.5(OUT) U4.17(PB_1)
USBHS_VBUSEN: R1.P$1 U2.1(EN)
VBUS: C16.P$1 J5.P$1(VBUS) R4.P$2 R7.P$2
VCL_F(FLASH): C36.P$2 U4.112(VCL_F(FLASH))
VDD: C10.P$2 C13.P$2 C14.P$2 C30.P$2 C32.P$1 C33.P$1 C34.P$1 C35.P$1 C48.1 C49.P$1 C54.P$2 C55.P$2 C56.P$2 C58.P$1 C59.P$1 C60.P$1 C61.P$2 FB2/2.1 J7.2 J7.4 L3.2 R2.P$1 R3.P$1 R8.P$1 R9.P$1 R10.P$1 R11.P$1 R13.P$2 R14.P$1 R18.P$2 R20.P$1 R21.P$1 R23.P$2 R24.P$2 R26.P$2 R27.P$2 R28.P$2 R29.P$2 U3.14(VDDIO) U4.25(VCC1) U4.26(AVCC_SUBHS) U4.34(VCC_USBHS) U4.48(VCC_USB) U4.61(VCC(IO)2) U4.84(VCC(IO)3) U4.97(VCC(IO)4) U4.110(VCC(IO)5) U4.123(VCC(IO)6) U4.138(VCC(IO)7) U4.149(VCC(IO)8) U4.155(AVCC0) U4.171(VCC(IO)9)
VDD5: C5.P$1 C8.P$1 J6.5 J6.6 R1.P$2 R12.P$2 U2.4(VIN)
VDD12: J6.7 J6.8
VDD_1.2: C45.P$1 C46.P$1 U3.1(VDD_1.2)
VDD_ENET1: C43.1 C44.P$1 FB2/2.2 U3.2(VDDA_3.3)
VDDIN: J6.3 J6.4 L3.1
XCIN: C50.P$1 U4.20(XCIN) X3.P$1
XCOUT: C51.P$1 U4.21(XCOUT) X3.P$2
XII: C42.P$1 U3.8(XI) U$3.1
XOO: C41.P$1 U3.7(XO) U$3.3
XTAL1: C52.P$1 U4.23(P2_13/XTAL) X4.1
XTAL2: C53.P$1 U4.24(P2_12/EXTAL) X4.3
Unconnected: U4.18(VBAT) U4.153(VREFL) U4.154(VREFH) U4.157(VREFL0) U4.158(VREFH0)

## Notes on the sheet
- Power Input | JTAG

## Library data of the parts
C5 C8 C10 C11 C13 C14 C16 C30-C42 C44-C46 C49-C61 U$4 = 3D_MIG_Controller:C_0402
C15 = 3D_MIG_Controller:C_1210
C43 C48 = 3D_MIG_Controller:C_0603
C47 R1-R14 R16-R21 R23-R33 RXS2-RXS4 RXS8 RYS3-RYS8 RYS15 RYS16 RZS2-RZS4 RZS8 U$1 U$5 U$6 U$8 U$10 U$12-U$18 U$32-U$35 = 3D_MIG_Controller:R_0402
FB2/2 = 3D_MIG_Controller:FB_0805_120_OHM
J3 = 3D_MIG_Controller:USB_A: USB-A Connector Male and female variants, as well as PTH and SMT variants SparkFun Products: SparkFun XBee Explorer Dongle <https://www.sparkfun.com/products/11697> PTH Male SparkFun MicroView-USB Programmer <https://www.sparkfun.com/products/12924> SMT Male SparkFun USB Type A Female Breakout <https://www.sparkfun.com/products/12700> SMT Female
J5 = 3D_MIG_Controller:USB_MICRO-B
J6 J7 = 3D_MIG_Controller:CONN_05X2: Multi connection point. Often used as Generic Header-pin footprint for 0.1 inch spaced/style header connections For AVR SPI programming port, see special device with nice symbol: "AVR_SPI_PROG_5x2.dev" You can populate with any combo of single row headers, but if you'd like an exact match, check these: 2x5 AVR ICSP Male Header <https://www.sparkfun.com/products/778> (PRT-00778) 2x5 Pin Shrouded Header <https://www.sparkfun.com/products/8506> (PRT-08506) On any of the 0.1 inch spaced packages, you can populate with these: Break Away Headers - Straight <https://www.sparkfun.com/products/116> (PRT-00116) Break Away Male Headers - Right Angle <https://www.sparkfun.com/products/553> (PRT-00553) Female Headers <https://www.sparkfun.com/products/115> (PRT-00115) Break Away Headers - Machine Pin <https://www.sparkfun.com/products/117> (PRT-00117) Break Away Female Headers - Swiss Machine Pin <https://www.sparkfun.com/products/743> (PRT-00743) Special note: the shrouded connector mates well with our 5x2 ribbon cables: 2x5 Pin IDC Ribbon Cable <https://www.sparkfun.com/products/8535> (PRT-08535); PROD_ID: CONN-08499; SF_ID: PRT-0778
J8 = 3D_MIG_Controller:HEADER_2_X_20_GENERIC
J9 = 3D_MIG_Controller:CONN_05X2: Multi connection point. Often used as Generic Header-pin footprint for 0.1 inch spaced/style header connections For AVR SPI programming port, see special device with nice symbol: "AVR_SPI_PROG_5x2.dev" You can populate with any combo of single row headers, but if you'd like an exact match, check these: 2x5 AVR ICSP Male Header <https://www.sparkfun.com/products/778> (PRT-00778) 2x5 Pin Shrouded Header <https://www.sparkfun.com/products/8506> (PRT-08506) On any of the 0.1 inch spaced packages, you can populate with these: Break Away Headers - Straight <https://www.sparkfun.com/products/116> (PRT-00116) Break Away Male Headers - Right Angle <https://www.sparkfun.com/products/553> (PRT-00553) Female Headers <https://www.sparkfun.com/products/115> (PRT-00115) Break Away Headers - Machine Pin <https://www.sparkfun.com/products/117> (PRT-00117) Break Away Female Headers - Swiss Machine Pin <https://www.sparkfun.com/products/743> (PRT-00743) Special note: the shrouded connector mates well with our 5x2 ribbon cables: 2x5 Pin IDC Ribbon Cable <https://www.sparkfun.com/products/8535> (PRT-08535); PROD_ID: CONN-09508
J10 J11 J14 = 3D_MIG_Controller:CONN_05X2: Multi connection point. Often used as Generic Header-pin footprint for 0.1 inch spaced/style header connections For AVR SPI programming port, see special device with nice symbol: "AVR_SPI_PROG_5x2.dev" You can populate with any combo of single row headers, but if you'd like an exact match, check these: 2x5 AVR ICSP Male Header <https://www.sparkfun.com/products/778> (PRT-00778) 2x5 Pin Shrouded Header <https://www.sparkfun.com/products/8506> (PRT-08506) On any of the 0.1 inch spaced packages, you can populate with these: Break Away Headers - Straight <https://www.sparkfun.com/products/116> (PRT-00116) Break Away Male Headers - Right Angle <https://www.sparkfun.com/products/553> (PRT-00553) Female Headers <https://www.sparkfun.com/products/115> (PRT-00115) Break Away Headers - Machine Pin <https://www.sparkfun.com/products/117> (PRT-00117) Break Away Female Headers - Swiss Machine Pin <https://www.sparkfun.com/products/743> (PRT-00743) Special note: the shrouded connector mates well with our 5x2 ribbon cables: 2x5 Pin IDC Ribbon Cable <https://www.sparkfun.com/products/8535> (PRT-08535)
J#1-J#3 J#5 J#7 = 3D_MIG_Controller:3.81MM_1_X_4_RT_ANGLE_PLUG_HEADER
L3 = 3D_MIG_Controller:INDUCTOR_1008_2.2_MH_1.3A
LED3 = 3D_MIG_Controller:LED_0805_GREEN
U2 = 3D_MIG_Controller:AP2141DWG-5
U3 = 3D_MIG_Controller:KSZ8081RNACA; MANUFACTURER_PART_NUMBER: KSZ8081RNACA; VENDOR: Micrel
U4 = 3D_MIG_Controller:S7G2_X_176
U7-U10 U12-U19 U32-U35 = 3D_MIG_Controller:BC846BW; MANUFACTURER_PART_NUMBER: BC846BW; VENDOR: Nexperia
U$2 = 3D_MIG_Controller:RJ45_WITH_ELEC
U$3 = 3D_MIG_Controller:XTAL_25_MHZ
X3 = 3D_MIG_Controller:XTAL_32.768KHZ
X4 = 3D_MIG_Controller:XTAL_24_MHZ

## Board
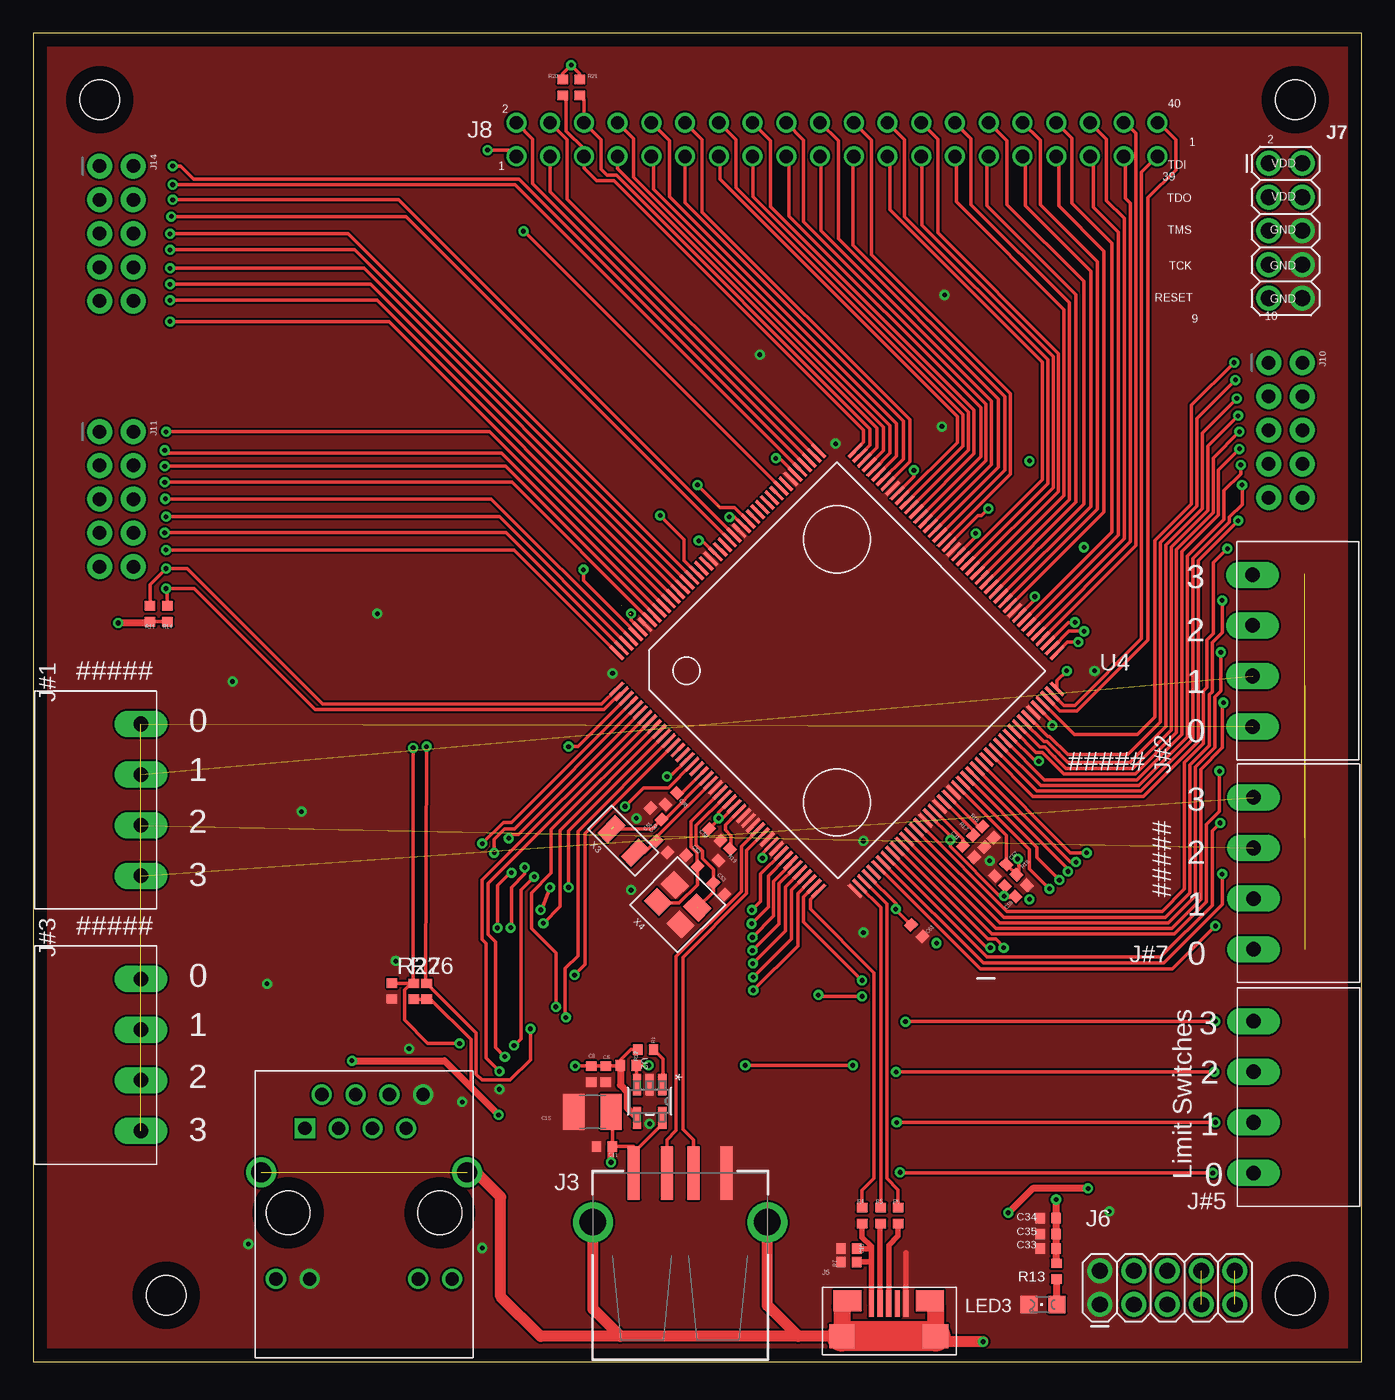
[diagram p5: board, top side]
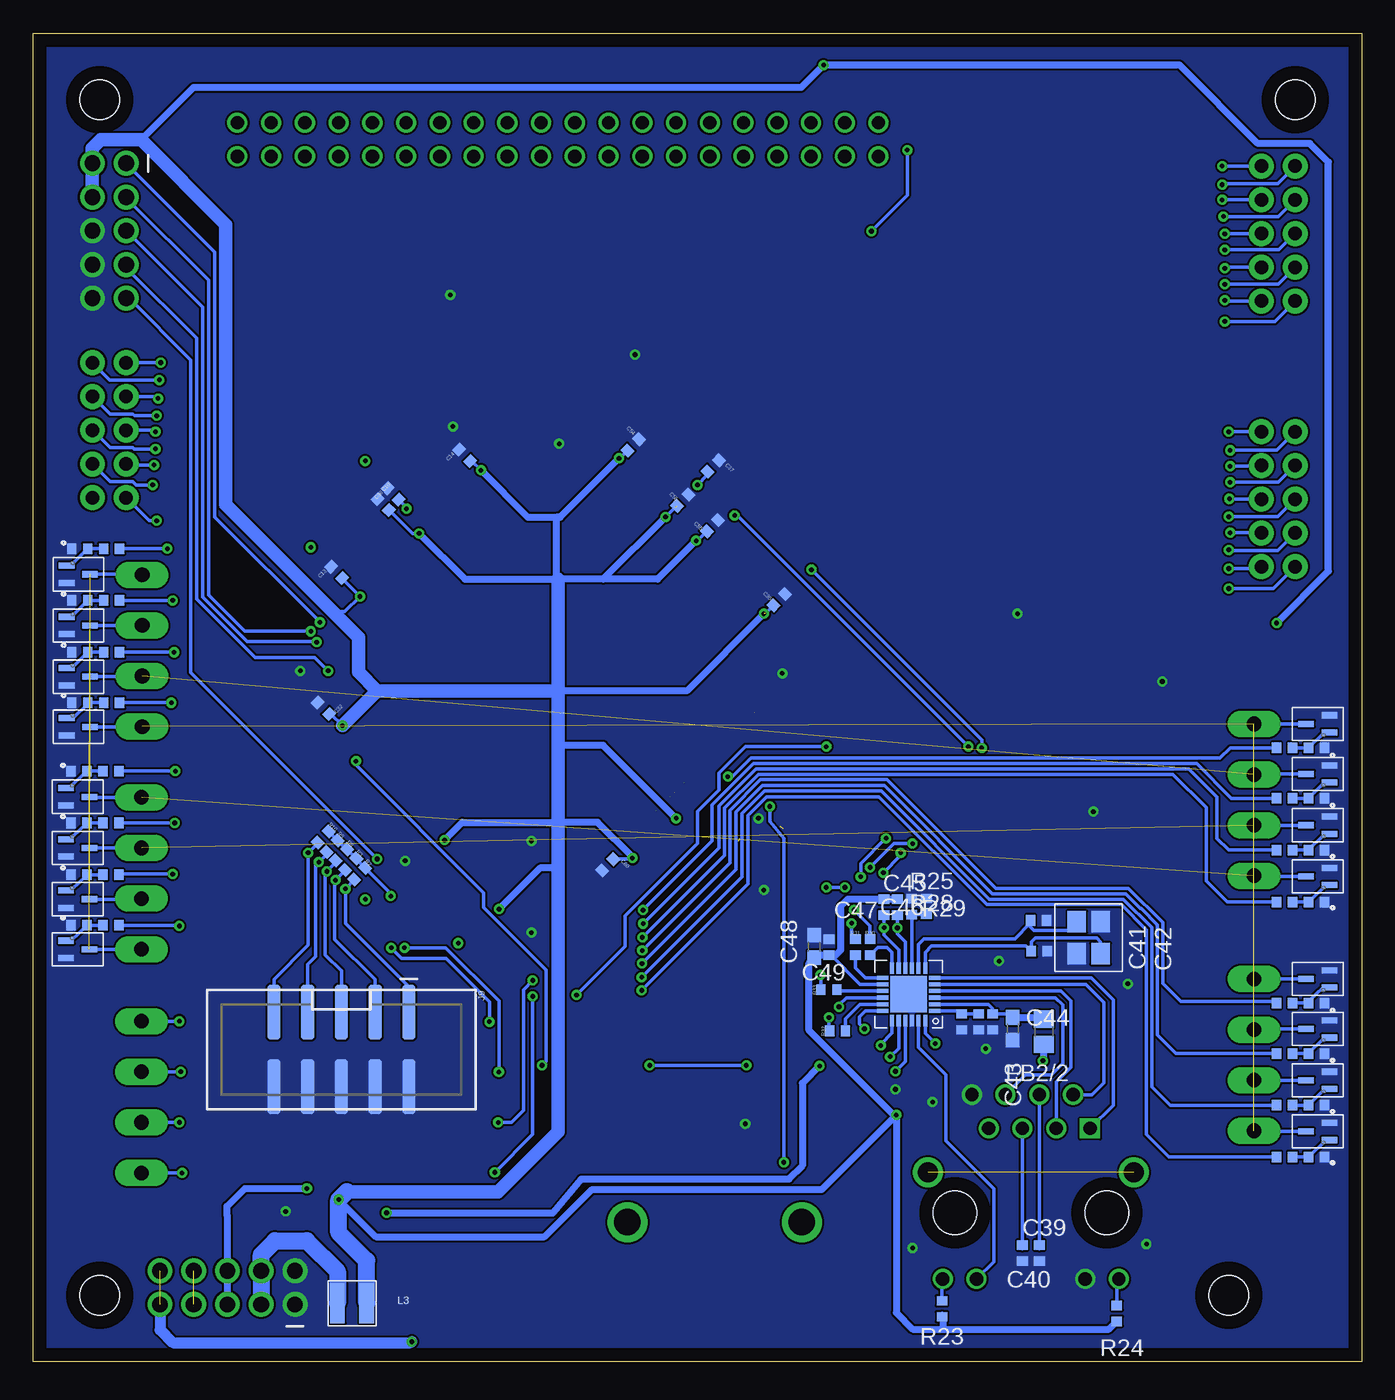
[diagram p6: board, bottom side, seen from below]

Size 100 x 100 mm. Coordinates in mm from the lower left corner, seen from the top.
Outline: 0,0 100,0 100,100 0,100 0,0
Copper layers (1*16): Top 0.035mm / dielectric 1.5mm / Bottom 0.035mm
Design rules "default": minimum track width 6mil, minimum drill 0.35mm, track to track 6mil, track to pad 6mil, pad to pad 6mil, via to via 6mil, smd to smd 6mil, copper to edge 40mil, drill to drill 6mil, minimum pad ring 10mil, minimum via ring 8mil, stop-mask expansion 4mil, vias tented up to drill 0mil, thermal gap 10mil
Holes 3 mm at 5,95 95,95 95,5 10,5

### Footprints (pad centres in the part's own frame; a part is rotated, then mirrored left to right if it is on the bottom)
0402 = smd 0.8 x 0.7: P$1 0,0.6; P$2 0,-0.6
C1210 = smd 1.6 x 2.7: 1 -1.4,0; 2 1.4,0
0603 = smd 1.1 x 1: 1 -0.85,0; 2 0.85,0
0805 = smd 1.3 x 1.5: 1 -0.95,0; 2 0.95,0
USB_A_SMT = smd 4 x 0.9: D+ 6.7,-1; D- 6.7,1; GND 6.7,-3.5; VBUS 6.7,3.5 | drill 2: SHLD1 3,-6.566; SHLD2 3,6.566
USB_MICRO-B = smd 0.4 x 2: P$1 -1.3,2.475; P$2 -0.65,2.475; P$3 0,2.475; P$4 0.65,2.475; P$5 1.3,2.475 | smd 2.1 x 1.6: P$6 -3.1,2.675; P$7 3.1,2.675 | smd 1.9 x 1.8: P$8 -3.525,0; P$9 3.525,0
2X5 = drill 1.2 pad 1.88: 1 0,0; 2 0,2.54; 3 2.54,0; 4 2.54,2.54; 5 5.08,0; 6 5.08,2.54; 7 7.62,0; 8 7.62,2.54; 9 10.16,0; 10 10.16,2.54
HEADER_2_X_20_.1_INCH = drill 1: P$1 -24.13,-1.27; P$2 -24.13,1.27; P$3 -21.59,-1.27; P$4 -21.59,1.27; P$5 -19.05,-1.27; P$6 -19.05,1.27; P$7 -16.51,-1.27; P$8 -16.51,1.27; P$9 -13.97,-1.27; P$10 -13.97,1.27; P$11 -11.43,-1.27; P$12 -11.43,1.27; P$13 -8.89,-1.27; P$14 -8.89,1.27; P$15 -6.35,-1.27; P$16 -6.35,1.27; P$17 -3.81,-1.27; P$18 -3.81,1.27; P$19 -1.27,-1.27; P$20 -1.27,1.27; P$21 1.27,-1.27; P$22 1.27,1.27; P$23 3.81,-1.27; P$24 3.81,1.27; P$25 6.35,-1.27; P$26 6.35,1.27; P$27 8.89,-1.27; P$28 8.89,1.27; P$29 11.43,-1.27; P$30 11.43,1.27; P$31 13.97,-1.27; P$32 13.97,1.27; P$33 16.51,-1.27; P$34 16.51,1.27; P$35 19.05,-1.27; P$36 19.05,1.27; P$37 21.59,-1.27; P$38 21.59,1.27; P$39 24.13,-1.27; P$40 24.13,1.27
2X5-SHROUDED_SMD = smd 4.15 x 1: 1 -2.794,5.08; 2 2.794,5.08; 3 -2.794,2.54; 4 2.794,2.54; 5 -2.794,0; 6 2.794,0; 7 -2.794,-2.54; 8 2.794,-2.54; 9 -2.794,-5.08; 10 2.794,-5.08
2X5_NOSILK = drill 1.016 pad 1.88: 1 0,0; 2 0,2.54; 3 2.54,0; 4 2.54,2.54; 5 5.08,0; 6 5.08,2.54; 7 7.62,0; 8 7.62,2.54; 9 10.16,0; 10 10.16,2.54
1X4_3.81MM_PITCH = drill 1.1 pad 2 long: P$1 0,0; P$2 3.81,0; P$3 7.62,0; P$4 11.43,0
1008_(2520_METRIC) = smd 3 x 1.1: 1 0,1.1; 2 0,-1.1
LED_0805_GREEN = smd 1.3 x 1.3: A 0,-1.05; C 0,1.05
SOT-23-5 = smd 1.626 x 0.61: 1 -1.245,0.95; 2 -1.245,0; 3 -1.245,-0.95; 4 1.245,-0.95; 5 1.245,0.95
QFN-24-M = smd 0.864 x 0.305: 1 -1.968,1.25; 2 -1.968,0.75; 3 -1.968,0.25; 4 -1.968,-0.25; 5 -1.968,-0.75; 6 -1.968,-1.25; 13 1.968,-1.25; 14 1.968,-0.75; 15 1.968,-0.25; 16 1.968,0.25; 17 1.968,0.75; 18 1.968,1.25 | smd 0.305 x 0.864: 7 -1.25,-1.968; 8 -0.75,-1.968; 9 -0.25,-1.968; 10 0.25,-1.968; 11 0.75,-1.968; 12 1.25,-1.968; 19 1.25,1.968; 20 0.75,1.968; 21 0.25,1.968; 22 -0.25,1.968; 23 -0.75,1.968; 24 -1.25,1.968 | smd 2.743 x 2.743: 25 0,0
LQFP176_24X24 = smd 1.372 x 0.254: 1 -12.675,10.75; 2 -12.675,10.25; 3 -12.675,9.75; 4 -12.675,9.25; 5 -12.675,8.75; 6 -12.675,8.25; 7 -12.675,7.75; 8 -12.675,7.25; 9 -12.675,6.75; 10 -12.675,6.25; 11 -12.675,5.75; 12 -12.675,5.25; 13 -12.675,4.75; 14 -12.675,4.25; 15 -12.675,3.75; 16 -12.675,3.25; 17 -12.675,2.75; 18 -12.675,2.25; 19 -12.675,1.75; 20 -12.675,1.25; 21 -12.675,0.75; 22 -12.675,0.25; 23 -12.675,-0.25; 24 -12.675,-0.75; 25 -12.675,-1.25; 26 -12.675,-1.75; 27 -12.675,-2.25; 28 -12.675,-2.75; 29 -12.675,-3.25; 30 -12.675,-3.75; 31 -12.675,-4.25; 32 -12.675,-4.75; 33 -12.675,-5.25; 34 -12.675,-5.75; 35 -12.675,-6.25; 36 -12.675,-6.75; 37 -12.675,-7.25; 38 -12.675,-7.75; 39 -12.675,-8.25; 40 -12.675,-8.75; 41 -12.675,-9.25; 42 -12.675,-9.75; 43 -12.675,-10.25; 44 -12.675,-10.75; 89 12.675,-10.75; 90 12.675,-10.25; 91 12.675,-9.75; 92 12.675,-9.25; 93 12.675,-8.75; 94 12.675,-8.25; 95 12.675,-7.75; 96 12.675,-7.25; 97 12.675,-6.75; 98 12.675,-6.25; 99 12.675,-5.75; 100 12.675,-5.25; 101 12.675,-4.75; 102 12.675,-4.25; 103 12.675,-3.75; 104 12.675,-3.25; 105 12.675,-2.75; 106 12.675,-2.25; 107 12.675,-1.75; 108 12.675,-1.25; 109 12.675,-0.75; 110 12.675,-0.25; 111 12.675,0.25; 112 12.675,0.75; 113 12.675,1.25; 114 12.675,1.75; 115 12.675,2.25; 116 12.675,2.75; 117 12.675,3.25; 118 12.675,3.75; 119 12.675,4.25; 120 12.675,4.75; 121 12.675,5.25; 122 12.675,5.75; 123 12.675,6.25; 124 12.675,6.75; 125 12.675,7.25; 126 12.675,7.75; 127 12.675,8.25; 128 12.675,8.75; 129 12.675,9.25; 130 12.675,9.75; 131 12.675,10.25; 132 12.675,10.75 | smd 0.254 x 1.372: 45 -10.75,-12.675; 46 -10.25,-12.675; 47 -9.75,-12.675; 48 -9.25,-12.675; 49 -8.75,-12.675; 50 -8.25,-12.675; 51 -7.75,-12.675; 52 -7.25,-12.675; 53 -6.75,-12.675; 54 -6.25,-12.675; 55 -5.75,-12.675; 56 -5.25,-12.675; 57 -4.75,-12.675; 58 -4.25,-12.675; 59 -3.75,-12.675; 60 -3.25,-12.675; 61 -2.75,-12.675; 62 -2.25,-12.675; 63 -1.75,-12.675; 64 -1.25,-12.675; 65 -0.75,-12.675; 66 -0.25,-12.675; 67 0.25,-12.675; 68 0.75,-12.675; 69 1.25,-12.675; 70 1.75,-12.675; 71 2.25,-12.675; 72 2.75,-12.675; 73 3.25,-12.675; 74 3.75,-12.675; 75 4.25,-12.675; 76 4.75,-12.675; 77 5.25,-12.675; 78 5.75,-12.675; 79 6.25,-12.675; 80 6.75,-12.675; 81 7.25,-12.675; 82 7.75,-12.675; 83 8.25,-12.675; 84 8.75,-12.675; 85 9.25,-12.675; 86 9.75,-12.675; 87 10.25,-12.675; 88 10.75,-12.675; 133 10.75,12.675; 134 10.25,12.675; 135 9.75,12.675; 136 9.25,12.675; 137 8.75,12.675; 138 8.25,12.675; 139 7.75,12.675; 140 7.25,12.675; 141 6.75,12.675; 142 6.25,12.675; 143 5.75,12.675; 144 5.25,12.675; 145 4.75,12.675; 146 4.25,12.675; 147 3.75,12.675; 148 3.25,12.675; 149 2.75,12.675; 150 2.25,12.675; 151 1.75,12.675; 152 1.25,12.675; 153 0.75,12.675; 154 0.25,12.675; 155 -0.25,12.675; 156 -0.75,12.675; 157 -1.25,12.675; 158 -1.75,12.675; 159 -2.25,12.675; 160 -2.75,12.675; 161 -3.25,12.675; 162 -3.75,12.675; 163 -4.25,12.675; 164 -4.75,12.675; 165 -5.25,12.675; 166 -5.75,12.675; 167 -6.25,12.675; 168 -6.75,12.675; 169 -7.25,12.675; 170 -7.75,12.675; 171 -8.25,12.675; 172 -8.75,12.675; 173 -9.25,12.675; 174 -9.75,12.675; 175 -10.25,12.675; 176 -10.75,12.675
SOT323 = smd 0.457 x 1.168: 1 -0.65,-0.876; 2 0.65,-0.876; 3 0,0.876
RJ45_TH_ELEC = drill 1 square: 1 -4.45,-2.54 | drill 1: 2 -3.18,0; 3 -1.91,-2.54; 4 -0.635,0; 5 0.635,-2.54; 6 1.91,0; 7 3.17,-2.54; 8 4.445,0; 9 -6.63,-13.88; 10 -4.09,-13.88; 11 4.09,-13.88; 12 6.63,-13.88 | drill 1.5: 13 -7.75,-5.84; 14 7.75,-5.84 | hole 3.299: 5.715,-8.89; -5.715,-8.89
SMD_3225 = smd 1.6 x 1.4: 1 -1.2,-0.9; 2 1.2,-0.9; 3 1.2,0.9; 4 -1.2,0.9
SMD_X_2_PADS = smd 1.9 x 1.1: P$1 0,1.25; P$2 0,-1.25

### Placement (x,y rotation side)
C5  43.1,21.65 0 top
C8  42,21.65 0 top
C10  73.65,64.52 45 bottom
C11  43,16.2 270 top
C13  77.16,59.41 45 bottom
C14  67.53,68.22 45 bottom
C15  42.1,18.8 180 top
C16  61.4,8.5 270 top
C30  43.85,57.36 315 bottom
C31  70.4,38.4 45 top
C32  78.16,49.19 225 bottom
C33  76.4,8.5 270 top
C34  76.4,10.8 270 top
C35  76.4,9.6 270 top
C36  72.91,65.32 45 bottom
C37  48.81,67.42 315 bottom
C38  48.03,42.37 315 top
C39  24.26,8.17 0 bottom
C40  25.54,8.17 0 bottom
C41  24.27,30.89 90 bottom
C42  24.32,33.21 90 bottom
C43  26.26,25.06 270 bottom
C44  27.79,25.58 0 bottom
C45  28.82,25.58 0 bottom
C46  30.1,25.58 0 bottom
C47  33.86,34.24 180 bottom
C48  41.2,31.25 90 bottom
C49  40.1,31.2 180 bottom
C50  46.88,41.24 225 top
C51  47.32,38.77 45 top
C52  49.57,37.7 225 top
C53  51.62,35.6 45 top
C54  54.83,69.01 315 bottom
C55  48.86,62.93 315 bottom
C56  51.1,64.85 315 bottom
C57  72.82,37 315 top
C58  51.31,39.66 45 top
C59  74.36,35.44 135 top
C60  56.76,37.4 315 bottom
C61  66.51,32.44 225 top
FB2/2  23.92,24.83 90 bottom
J3  48.7,7.5 90 top
J5  64.4,1.9 0 top
J6  80.3,4.3 0 top
J7  93,90.2 270 top
J8  60.5,92 0 top
J9  76.8,23.5 270 bottom
J10  93,75.2 270 top
J11  5,70 270 top
J14  5,90 270 top
J#1  8.1,48 270 top
J#2  91.8,47.8 90 top
J#3  8.1,28.8 270 top
J#5  91.85,14.2 90 top
J#7  91.85,31.05 90 top
L3  76,4.4 90 bottom
LED3  76,4.3 90 top
R1  46.1,23.5 270 top
R2  75.43,36.73 315 bottom
R3  76.1,37.44 315 bottom
R4  62.4,11 0 top
R5  63.8,11 0 top
R6  65.1,11 0 top
R7  61.4,7.5 90 top
R8  76.8,38.15 315 bottom
R9  77.5,38.8 315 bottom
R10  78.18,39.5 315 bottom
R11  8.8,56.3 180 top
R12  44.8,22.3 270 top
R13  77.03,6.81 180 top
R14  10.1,56.3 180 top
R16  71.87,39.86 225 top
R17  71.18,39.17 225 top
R18  73.57,36.23 315 top
R19  52.02,38.16 135 top
R20  39.85,95.92 0 top
R21  41.13,95.92 0 top
R23  31.59,3.98 0 bottom
R24  18.44,3.63 0 bottom
R25  32.76,34.27 0 bottom
R26  29.61,27.88 0 top
R27  28.64,27.88 0 top
R28  35.96,34.22 180 bottom
R29  34.94,34.22 180 bottom
R30  37,31.2 0 bottom
R31  38.1,31.2 0 bottom
R32  39.45,24.9 90 bottom
R33  40.1,28 90 bottom
RXS2  5.8,46.2 90 bottom
RXS3  94.1,49.6 270 bottom
RXS4  5.8,27 90 bottom
RXS8  94.15,32.85 270 bottom
RYS3  5.8,42.4 90 bottom
RYS4  5.8,34.6 90 bottom
RYS5  94.1,53.4 270 bottom
RYS6  94.1,61.2 270 bottom
RYS7  5.8,23.2 90 bottom
RYS8  5.8,15.4 90 bottom
RYS15  94.15,36.65 270 bottom
RYS16  94.15,44.45 270 bottom
RZS2  5.8,38.5 90 bottom
RZS3  94.1,57.3 270 bottom
RZS4  5.8,19.3 90 bottom
RZS8  94.15,40.55 270 bottom
U2  46.4,19.6 270 top
U3  34.1,27.65 180 bottom
U4  60.5,52 45 top
U7  3.3,40.38 90 bottom
U8  3.3,48.01 90 bottom
U9  3.3,44.24 90 bottom
U10  3.3,36.53 90 bottom
U12  96.6,55.42 270 bottom
U13  96.6,47.79 270 bottom
U14  96.6,51.56 270 bottom
U15  96.6,59.27 270 bottom
U16  3.3,21.18 90 bottom
U17  3.3,28.81 90 bottom
U18  3.3,25.04 90 bottom
U19  3.3,17.33 90 bottom
U32  96.65,38.67 270 bottom
U33  96.65,31.04 270 bottom
U34  96.65,34.81 270 bottom
U35  96.65,42.52 270 bottom
U$1  3.4,38.5 90 bottom
U$2  24.9,20.1 0 top
U$3  20.55,31.91 270 bottom
U$4  27.01,27.9 0 top
U$5  3.4,46.2 90 bottom
U$6  3.4,42.4 90 bottom
U$8  3.4,34.6 90 bottom
U$10  96.5,57.3 270 bottom
U$12  96.5,49.6 270 bottom
U$13  96.5,53.4 270 bottom
U$14  96.5,61.2 270 bottom
U$15  3.4,19.3 90 bottom
U$16  3.4,27 90 bottom
U$17  3.4,23.2 90 bottom
U$18  3.4,15.4 90 bottom
U$32  96.55,40.55 270 bottom
U$33  96.55,32.85 270 bottom
U$34  96.55,36.65 270 bottom
U$35  96.55,44.45 270 bottom
X3  44.41,39.2 45 top
X4  48.51,34.39 315 top

### Tracks (layer width: path | path; a pad name or v marks a point on that pad's centre or on a via)
C58
  Bottom 0.254: U$2.4 24.27,8.5 C39.P$1
C60
  Bottom 0.254: U$2.5 25.54,8.5 C40.P$1
CRS_DV
  Bottom 0.254: U3.15 39.4,27.9 R33.P$2
D+
  Top 0.4: J5.P$3 64.4,8.78 65.1,9.47 R6.P$2
D-
  Top 0.4: J5.P$2 63.75,10.35 R5.P$2
ETH  (via drill 0.35)
  Top 0.254: v39.35,26.7 39.35,30.75 37.5,32.6 37.5,35.3 39,36.8 39,40.05 U4.9
  Bottom 0.254: U3.16 38.8,27.4 39.35,26.85 v39.35,26.7
ETH_CRS_DV  (via drill 0.35)
  Top 0.254: v40.75,29.1 41.55,29.9 41.55,39.77 U4.13
  Bottom 0.254: v40.75,29.1 40.7,29.05 R33.P$1
ETH_IRQ14  (via drill 0.35)
  Top 0.254: v37.43,25.05 37.43,22.73 35.89,21.19 33.81,21.19 33.36,21.64 33.36,24.73 R26.P$1 29.54,28.55 v29.6,46.3 | v47.2,63.7 49,61.9 49,60.32 U4.159
  Bottom 0.254: U3.18 37.35,26.4 37.8,25.95 37.8,25.42 v37.43,25.05 | v47.2,63.7 47,63.7 v29.6,46.3
ETH_MDC  (via drill 0.35)
  Top 0.254: v33.8,39 35.4,40.6 36.02,40.6 U4.4 | v37,37.2 37,36.7 36,35.7 36,32.71 v35.95,32.66
  Bottom 0.254: U3.11 34.85,31 35.96,32.11 v35.95,32.66 R28.P$1 | v33.8,39 35.2,39 v37,37.2
ETH_MDIO  (via drill 0.35)
  Top 0.254: v34.94,32.65 34.94,35.85 35.89,36.8 v36,36.8 | v34.7,38.3 34.7,39.3 35.5,40.1 36.23,40.1 U4.5
  Bottom 0.254: U3.10 34.35,31.6 34.94,32.19 v34.94,32.65 R29.P$1 | v34.7,38.3 34.7,38.1 v36,36.8
ETH_RESET  (via drill 0.35)
  Top 0.254: v32.1,23.95 29.7,23.95 27.94,25.71 27.94,27.98 28.44,28.48 | 28.44,28.48 R27.P$1 28.6,28.52 v28.6,46.2 | 28.44,28.48 27.03,28.48 U$4.P$1 | v41.41,59.61 41.41,58.81 45.35,54.88 U4.172
  Bottom 0.254: U3.24 32.85,24.7 v32.1,23.95 | v41.41,59.61 28.6,46.8 v28.6,46.2
ETH_RX_ER  (via drill 0.35)
  Top 0.254: v40.1,25.9 40.05,25.95 40.05,29.6 41,30.55 41,39.92 U4.12
  Bottom 0.254: R32.P$1 40.1,24.95 v40.1,25.9
ETH_RXD0  (via drill 0.35)
  Top 0.254: v38.4,33 39.65,34.25 39.65,39.99 U4.10
  Bottom 0.254: v38.4,33 38.4,32.1 R31.P$1
ETH_RXD1  (via drill 0.35)
  Top 0.254: v38.9,35.69 38.29,34.09 v38.2,34 | v40.3,35.7 40.3,39.95 47.47,47.12 U4.11
  Bottom 0.254: v38.2,34 37,32.8 R30.P$1 | v40.3,35.7 v38.9,35.69
ETH_TXD0  (via drill 0.35)
  Top 0.254: v35.5,22.95 34.8,23.65 34.8,31.6 34.25,32.15 34.25,36 U4.8
  Bottom 0.254: U3.20 34.85,23.6 v35.5,22.95
ETH_TXD1  (via drill 0.35)
  Top 0.254: v35.1,21.85 34.1,22.85 34.1,31.5 33.8,31.8 33.8,36.24 46.06,48.5 U4.7
  Bottom 0.254: U3.21 34.35,22.6 v35.1,21.85
ETH_TXD_EN  (via drill 0.35)  (1 unrouted)
  Top 0.254: v36.2,23.8 36.71,24.31 36.71,35.5 v37.71,36.5 | v35.8,39.4 36.09,39.69 36.53,39.69 U4.6
  Bottom 0.254: U3.19 35.35,24.75 36.2,23.9 v36.2,23.8 | v35.8,39.4 35.83,39.4 37.71,37.52 v37.71,36.5
F0_OUT  (3 unrouted)
  Bottom 0.254: U8.3 J#1.P$1 | U17.3 J#3.P$1 | U33.3 J#7.P$1 | U13.3 J#2.P$1
F1_OUT  (3 unrouted)
  Bottom 0.254: U9.3 8.05,44.24 J#1.P$2 | U18.3 8.05,25.04 J#3.P$2 | U34.3 91.9,34.81 J#7.P$2 | U14.3 91.85,51.56 J#2.P$2
F2_OUT  (3 unrouted)
  Bottom 0.254: U7.3 J#1.P$3 | U16.3 J#3.P$3 | U32.3 J#7.P$3 | U12.3 J#2.P$3
F3_OUT  (3 unrouted)
  Bottom 0.254: U10.3 8.06,36.53 J#1.P$4 | U19.3 8.06,17.33 J#3.P$4 | U35.3 95.73,42.48 J#7.P$4 | U15.3 91.84,59.27 J#2.P$4
GND  (via drill 0.35)
  Top 0.4: J5.P$5 65.7,8.2
  other vias: 15,51.2 28.3,23.55 32.3,19.55 27.3,30.15 33.8,8.55 16.2,8.85 17.6,28.45 35.1,20.5 46.4,17.9 45,35.5 43.61,51.82 62.5,32.3 72,37.7 68.6,80.3 68.4,70.4 54.7,75.8 60.4,69.1 62.5,39.2 79.9,52 20.2,41.4 25.9,56.3 81,11.3 45.4,40.9
  pour Bottom (no thermals): 67,0 100,0 100,100 0,100 0,0
  pour Top (no thermals): 0,0 100,0 100,100 0,100
GNDE  (via drill 0.35)  (2 unrouted)
  Top 0.813: v71.5,1.5 68.33,1.5 J5.P$9 | J5.P$7 67.92,4.15 | J5.P$6 60.88,4.15 | J5.P$8 57.6,1.9 | J3.SHLD1 55.27,4.23 57.6,1.9 | 57.6,1.9 44.2,1.9 | J3.SHLD2 42.13,3.97 44.2,1.9 | 44.2,1.9 38.2,1.9 35.2,4.9 35.2,12.4 33.34,14.26 U$2.14
  Top 1.27: 67.92,4.15 J5.P$9 | 60.88,4.15 J5.P$8
  Top 2.25: J5.P$9 J5.P$8
  Bottom 0.813: J6.9 90.46,2.38 89.5,1.42 71.58,1.42 v71.5,1.5
GP4
  Top 0.254: U4.49 63.31,36.81 63.31,36.8
GP21
  Top 0.254: U4.73
IIC_0_SCL  (via drill 0.35)
  Top 0.254: U4.1 42.8,49.5 21.8,49.5 11.6,59.7 v10,59.7 8.8,58.5 R11.P$2
  Bottom 0.254: v10,59.7 7.68,59.7 J11.10
IIC_0_SDA  (via drill 0.35)
  Top 0.254: U4.2 44.16,50.29 42.97,49.09 21.21,49.09 12.1,58.2 v10,58.2 10.1,58.1 R14.P$2
  Bottom 0.254: v10,58.2 6.64,58.2 J11.9
IIC_1_SCL
  Top 0.254: U4.132 62.5,69.2 62.5,70.12 43.73,88.89 42.41,88.89 41.45,89.85 J8.P$5 41.45,91.31 40.12,92.64 40.12,94.95 39.85,95.22 R20.P$2
IIC_1_SDA
  Top 0.254: U4.131 63,69 63,70.2 43.9,89.3 43.18,89.3 42.73,89.75 42.73,91.99 J8.P$6 | 41.11,95.29 R21.P$2 41.46,94.99 J8.P$6 | J8.P$6
INT_AI_LS_0  (via drill 0.35)
  Top 0.254: U4.3 41.01,46.3 v40.3,46.3 | v62.4,27.5 59.2,27.5 v59.1,27.6 | v65.25,14.25 65.3,14.2 v88.8,14.2
  Bottom 0.254: v40.3,46.3 46.38,46.3 48.37,44.31 48.37,43.03 50,41.4 50,39.02 55.46,33.56 55.46,31.24 v59.1,27.6 | v65.25,14.25 62.4,17.1 v62.4,27.5 | v88.8,14.2 J#5.P$1
INT_AI_LS_1  (via drill 0.35)
  Top 0.254: U4.43 58.79,35.76 57.99,34.97 57.99,33.11 v62.4,28.7 | v65,18 v65.01,18.01 v89,18.01
  Bottom 0.254: v62.4,28.7 63.1,28 63.1,18.9 64,18 v65,18 | v89,18.01 J#5.P$2
INT_AI_LS_2  (via drill 0.35)
  Top 0.254: U4.53 71.8,31.15 v72.05,31.15 | v64.95,21.8 64.97,21.82 v88.9,21.82
  Bottom 0.254: v88.9,21.82 J#5.P$3 | v72.05,31.15 68.95,31.15 64.95,27.15 v64.95,21.8
INT_AI_LS_3  (via drill 0.35)
  Top 0.254: U4.54 71.85,31.81 72.45,31.81 73.05,31.21 v73.05,31.15 | v65.66,25.59 65.7,25.63 v89,25.63
  Bottom 0.254: v89,25.63 J#5.P$4 | v65.66,25.59 65.66,27.09 68.92,30.35 72.25,30.35 v73.05,31.15
INT_MI_01
  Top 0.254: U4.87 77.6,49.4 78.4,49.4 83.43,54.43 83.43,89.53 J8.P$39
INT_MI_02
  Top 0.254: U4.86 77.3,48.99 78.57,48.99 83.91,54.33 83.91,87.61 86,89.7 86,92 84.73,93.27 J8.P$40
INT_MI_03
  Top 0.254: U4.128 64.5,68.37 64.5,70.45 46.7,88.25 46.7,90.56 J8.P$9
INT_MI_04
  Top 0.254: U4.127 64.99,68.16 64.99,70.6 47.9,87.69 47.9,91.9 J8.P$10
INT_MI_05  (via drill 0.35)
  Top 0.254: U4.141 36.95,85.1 v36.9,85.1 | v34.2,91.2 35.9,91.2 J8.P$1
  Bottom 0.254: v36.9,85.1 34.2,87.8 v34.2,91.2
LED1/SPEED
  Bottom 0.254: U3.23 33.35,23.65 31.3,21.6 31.3,16.63 27.69,13.02 27.69,7.52 U$2.11
M0_DIR  (via drill 0.35)
  Top 0.254: U4.39 56.15,35.98 56.15,32.95 v54.15,30.95
  Bottom 0.254: RXS4.P$1 6.5,27.1 13.6,27.1 14.98,28.48 14.98,33.06 17.54,35.62 27.54,35.62 35.73,43.81 45.24,43.81 47.55,41.5 47.55,37.55 v54.15,30.95
M0_STEP  (via drill 0.35)
  Top 0.254: 49.24,45.32 U4.16 47.94,44.03 v47.72,44.03
  Bottom 0.254: RXS2.P$1 9.9,46.2 10.67,45.43 45.96,45.43 47.36,44.03 v47.72,44.03
M1_DIR  (via drill 0.35)
  Top 0.254: U4.40 56.62,35.74 56.62,32.42 v54.17,29.97
  Bottom 0.254: v54.17,29.97 47.1,37.04 47.1,41.38 45.12,43.36 35.93,43.36 27.79,35.21 17.76,35.21 16.65,34.1 16.6,34.1 15.39,32.89 15.39,24.59 14,23.2 RYS7.P$1
M1_STEP  (via drill 0.35)
  Top 0.254: U4.36 54.75,36.7 54.75,34.64 v54.1,33.99
  Bottom 0.254: v54.1,33.99 48.9,39.19 48.9,41.92 45.79,45.03 12.42,45.03 9.79,42.4 RYS3.P$1
M2_DIR  (via drill 0.35)
  Top 0.254: v54.19,28.94 57.09,31.84 57.09,35.51 U4.41
  Bottom 0.254: RZS4.P$1 14.4,19.3 15.79,20.69 15.79,32.67 17.93,34.81 28.01,34.81 36.15,42.95 44.95,42.95 46.65,41.25 46.65,36.48 v54.19,28.94
M2_STEP  (via drill 0.35)
  Top 0.254: U4.37 55.33,36.58 55.33,34.22 v54.08,32.97
  Bottom 0.254: v54.08,32.97 48.38,38.67 48.38,41.82 45.58,44.62 13.02,44.62 10.9,42.5 10.9,39.4 10,38.5 RZS2.P$1
M3_DIR  (via drill 0.35)
  Top 0.254: U4.42 57.55,35.26 57.55,31.3 v54.2,27.95
  Bottom 0.254: v54.2,27.95 46.2,35.95 46.2,41.12 44.82,42.51 36.33,42.51 28.23,34.4 18.1,34.4 16.2,32.5 16.2,17.1 14.5,15.4 RYS8.P$1
M3_STEP  (via drill 0.35)
  Top 0.254: U4.38 57.02,37.42 55.74,36.15 55.74,33.54 v54.14,31.94
  Bottom 0.254: v54.14,31.94 47.96,38.12 47.96,41.67 45.41,44.21 14.21,44.21 11.7,41.7 11.7,36.2 10.1,34.6 RYS4.P$1
N$1  (via drill 0.35)
  Top 0.254: U4.148 52.8,64.3 51.7,64.3 v50,66
  Bottom 0.254: v50,66 49.23,66.77 C37.P$2
N$2  (via drill 0.35)
  other vias: 79.1,61.3
N$3
  Top 0.508: R13.P$1 77.03,4.32 LED3.A
N$4
  Top 0.254: U4.19 48.82,42.8 C38.P$1
N$5
  Top 0.254: U4.62 69.98,39.34 C31.P$1
N$6
  Top 0.254: R17.P$2 70.76,39.97 U4.64
N$7
  Top 0.254: U4.65 71.15,40.29 R16.P$2
N$8  (1 unrouted)
  Top 0.254: 52.52,40.84 U4.27 52.1,40.42 52.1,40.03 52.54,39.59 52.54,38.68 R19.P$2
N$9  (via drill 0.35)
  other vias: 75,67.8
N$10  (via drill 0.35)
  other vias: 75,34.8
N$11
  Bottom 0.254: U7.1 2.75,39.73 2.88,39.62 U$1.P$1 RZS2.P$2
N$12
  Bottom 0.254: U8.1 2.8,47.36 U$5.P$1 RXS2.P$2
N$13
  Bottom 0.254: U9.1 2.81,43.59 U$6.P$1 RYS3.P$2
N$14
  Bottom 0.254: U10.1 2.62,35.88 U$8.P$1 RYS4.P$2
N$15
  Bottom 0.254: U12.1 97.13,56.07 U$10.P$1 RZS3.P$2
N$16
  Bottom 0.254: U13.1 97,48.44 95.9,49.5 U$12.P$1 RXS3.P$2
N$17
  Bottom 0.254: U14.1 97.09,52.21 U$13.P$1 RYS5.P$2
N$18
  Bottom 0.254: U15.1 97.18,59.92 U$14.P$1 RYS6.P$2
N$19
  Bottom 0.254: U16.1 2.75,20.53 2.88,20.43 U$15.P$1 RZS4.P$2
N$20
  Bottom 0.254: U17.1 2.9,28.16 4,27.1 U$16.P$1 RXS4.P$2
N$21  (via drill 0.35)
  other vias: 68,31.5
N$22
  Bottom 0.254: U18.1 2.81,24.39 U$17.P$1 RYS7.P$2
N$23
  Bottom 0.254: U19.1 2.62,16.68 U$18.P$1 RYS8.P$2
N$36
  Bottom 0.254: U32.1 97.3,39.32 96.56,39.94 U$32.P$1 RZS8.P$2
N$37
  Bottom 0.254: U33.1 97.15,31.69 U$33.P$1 RXS8.P$2
N$38
  Bottom 0.254: U34.1 97.22,35.46 96.64,35.95 U$34.P$1 RYS15.P$2
N$39
  Bottom 0.254: U35.1 97.33,43.17 U$35.P$1 RYS16.P$2
P0_00  (via drill 0.35)
  Top 0.254: U4.169 36.05,66.2 v9.9,66.2
  Bottom 0.254: v9.9,66.2 6.26,66.2 J11.3
P0_01  (via drill 0.35)
  Top 0.254: U4.168 35.55,67.4 v9.9,67.4
  Bottom 0.254: v9.9,67.4 7.6,67.4 J11.4
P0_02  (via drill 0.35)
  Top 0.254: v9.9,68.6 10.1,68.4 35.26,68.4 U4.167
  Bottom 0.254: v9.9,68.6 6.4,68.6 J11.1
P0_03  (via drill 0.35)
  Top 0.254: U4.166 34.37,70 v10,70
  Bottom 0.254: v10,70 J11.2
P0_04  (via drill 0.35)
  Top 0.254: v10.3,78.3 26.77,78.3 U4.165
  Bottom 0.254: J14.9 6.54,78.3 v10.3,78.3
P0_05  (via drill 0.35)
  Top 0.254: v10.3,79.9 25.88,79.9 U4.164
  Bottom 0.254: J14.10 10.24,79.84 v10.3,79.9
P0_06  (via drill 0.35)
  Top 0.254: U4.163 25.39,81.1 v10.3,81.1
  Bottom 0.254: J14.7 6.28,81.1 v10.3,81.1
P0_07  (via drill 0.35)
  Top 0.254: 48.85,58.31 U4.162 24.9,82.3 v10.3,82.3
  Bottom 0.254: J14.8 10.22,82.38 v10.3,82.3
P0_08  (via drill 0.35)
  Top 0.254: v10.3,83.7 24.2,83.7 U4.161
  Bottom 0.254: J14.5 6.22,83.7 v10.3,83.7
P0_09  (via drill 0.35)
  Top 0.254: v10.3,84.9 23.71,84.9 U4.160
  Bottom 0.254: J14.6 10.28,84.92 v10.3,84.9
P0_14  (via drill 0.35)
  Top 0.254: v10.4,86.2 28.07,86.2 U4.152
  Bottom 0.254: J14.3 6.26,86.2 v10.4,86.2
P0_15  (via drill 0.35)
  Top 0.254: U4.151 27.52,87.46 v10.5,87.46
  Bottom 0.254: v10.5,87.46 J14.4
P1_02
  Top 0.254: U4.130 63.5,68.79 63.5,70.28 43.99,89.78 J8.P$7
P1_03
  Top 0.254: U4.129 64,68.58 64,70.35 45.2,89.15 45.2,92.06 J8.P$8
P1_06
  Top 0.254: U4.126 65.5,67.96 65.5,70.8 49.07,87.23 J8.P$11
P1_07
  Top 0.254: U4.125 66,67.75 66,70.9 50.36,86.54 50.36,91.98 J8.P$12
P1_11
  Top 0.254: U4.92 83.02,61.44 83.02,92.49 82.24,93.27 J8.P$38
P1_12
  Top 0.254: U4.93 82.59,61.72 82.59,87.21 82.2,87.6 82.2,90.62 J8.P$37
P1_13
  Top 0.254: U4.94 82.13,61.96 82.13,86.07 80.8,87.4 80.8,92.02 J8.P$36
P1_14
  Top 0.254: U4.95 81.68,62.22 81.68,85.02 79.8,86.9 79.8,90.48 J8.P$35
P1_15
  Top 0.254: U4.96 81.2,62.45 81.2,84.2 78.2,87.2 78.2,92.08 J8.P$34
P2_00  (via drill 0.35)
  Top 0.254: U4.69 75.55,38.72 75.55,37.95 v77.25,36.25
  Bottom 0.254: R3.P$2 76.52,36.98 v77.25,36.25 77.3,36.2 77.3,31.8 74.26,28.76 J9.3
P2_01  (via drill 0.35)
  Top 0.254: 76.5,35.7 v76.5,35.6 75,37.1 75,38.56 U4.68
  Bottom 0.254: R2.P$2 75.85,36.25 v76.5,35.6 76.5,33 71.72,28.22 J9.1
P3_03  (via drill 0.35)
  Top 0.254: U4.85 78.38,47.2 78.4,47.2 83.1,47.2 84.44,48.54 84.44,61.82 87.2,64.57 87.2,72 v90.4,75.2
  Bottom 0.254: v90.4,75.2 J10.1
P3_04  (via drill 0.35)
  Top 0.254: U4.82 76.38,47.08 76.5,47.08 77.88,45.7 82.4,45.7 84.85,48.15 84.85,61.65 87.6,64.4 87.6,71 v90.5,73.9
  Bottom 0.254: v90.5,73.9 94.24,73.9 J10.2
P3_05  (via drill 0.35)
  Top 0.254: U4.81 76.08,46.67 76.31,46.67 77.18,45.8 | 77.18,45.8 77.2,45.8 | 77.18,45.8 77.88,45.1 82.56,45.1 85.25,47.8 85.25,61.48 88.01,64.23 88.01,69.91 v90.6,72.5
  Bottom 0.254: v90.6,72.5 90.76,72.66 J10.3
P3_06  (via drill 0.35)
  Top 0.254: U4.80 75.78,46.26 76.14,46.26 76.76,45.64 | 76.76,45.64 76.9,45.5 | 76.76,45.64 77.75,44.66 82.78,44.66 85.66,47.53 85.66,61.31 88.42,64.07 88.42,68.92 v90.7,71.2
  Bottom 0.254: v90.7,71.2 92.36,71.2 92.5,71.34 94.22,71.34 J10.4
P3_07  (via drill 0.35)
  Top 0.254: U4.79 75.48,45.86 75.97,45.86 76.36,45.47 77.58,44.25 82.95,44.25 86.07,47.37 86.07,61.14 88.82,63.9 88.82,68.02 v90.8,70
  Bottom 0.254: v90.8,70 90.92,70.12 J10.5
P3_09  (via drill 0.35)
  Top 0.254: U4.77 76.12,43.8 83.08,43.8 86.47,47.2 86.47,60.97 89.23,63.73 89.23,67.13 v90.8,68.7
  Bottom 0.254: v90.8,68.7 92.4,68.7 92.5,68.8 94.22,68.8 J10.6
P3_10  (via drill 0.35)
  Top 0.254: U4.76 75.86,43.36 83.21,43.36 86.88,47.03 86.88,60.63 89.64,63.38 89.64,65.57 90.9,66.83 v90.9,67.5
  Bottom 0.254: v90.9,67.5 92.92,67.5 J10.7
P3_11  (via drill 0.35)
  Top 0.254: U4.75 75.55,42.96 83.38,42.96 87.29,46.86 87.29,60.46 90.04,63.22 90.04,63.57 91,64.53 v91,66
  Bottom 0.254: v91,66 92.24,66 92.5,66.26 94.22,66.26 J10.8
P3_12  (via drill 0.35)
  Top 0.254: U4.74 75.25,42.55 83.55,42.55 87.69,46.69 87.69,60.29 v90.7,63.3
  Bottom 0.254: v90.7,63.3 91.26,63.3 J10.9
P5_04
  Top 0.254: U4.144 55.23,64.67
P5_05
  Top 0.254: U4.145 54.9,64.35
P5_11  (via drill 0.35)
  Top 0.254: 43.9,53.4 U4.176 36.2,61.1 v10,61.1
  Bottom 0.254: v10,61.1 9.96,61.06 6.32,61.06 J11.7
P5_12  (via drill 0.35)
  Top 0.254: U4.175 35.6,62.4 v9.9,62.4
  Bottom 0.254: v9.9,62.4 7.56,62.4 J11.8
P5_13  (via drill 0.35)
  Top 0.254: U4.174 35.11,63.6 v10,63.6
  Bottom 0.254: v10,63.6 6.32,63.6 J11.5
P6_00
  Top 0.254: U4.122 69.57,69.2 69.57,71.12 51.7,89 51.7,90.64 J8.P$13
P6_01
  Top 0.254: U4.121 69.99,68.92 69.99,71.28 52.9,88.37 52.9,91.98 J8.P$14
P6_02
  Top 0.254: U4.120 70.4,68.62 70.4,71.48 54.2,87.68 54.2,90.68 J8.P$15
P6_03
  Top 0.254: U4.119 70.83,68.34 70.83,71.63 55.5,86.96 55.5,91.92 J8.P$16
P6_04
  Top 0.254: U4.118 71.32,68.13 71.32,71.82 56.9,86.24 56.9,90.52 J8.P$17
P6_05
  Top 0.254: U4.117 71.73,67.83 71.73,72.08 58,85.81 58,91.96 J8.P$18
P6_06
  Top 0.254: U4.116 72.15,67.54 72.15,72.3 59.3,85.15 59.3,90.66 J8.P$19
P6_07
  Top 0.254: U4.115 72.64,67.33 72.64,72.47 60.6,84.52 60.6,91.9 J8.P$20
P6_08
  Top 0.254: U4.99 80.6,63.97 80.6,83.6 77.2,87 77.2,90.54 J8.P$33
P6_09
  Top 0.254: U4.100 80.1,64.17 80.1,82.8 75.8,87.1 75.8,91.94 J8.P$32
P6_10
  Top 0.254: U4.101 79.6,64.38 79.6,82.1 74.7,87 74.7,90.5 J8.P$31
P6_11
  Top 0.254: U4.102 79.08,64.57 79.08,81.32 73.3,87.1 73.3,91.9 J8.P$30
P6_12
  Top 0.254: U4.103 78.5,64.7 78.5,80.31 71.8,87.02 71.8,90.6 J8.P$29
P6_13
  Top 0.254: U4.104 78,64.9 78,79.7 70.6,87.1 70.6,92.06 J8.P$28
P6_14
  Top 0.254: U4.105 77.59,65.2 77.59,79.21 69.5,87.3 69.5,90.62 J8.P$27
P6_15
  Top 0.254: U4.106 77.19,65.5 77.19,75.89 68.1,84.98 68.1,92.02 J8.P$26
P8_00
  Top 0.254: U4.133 40.2,87.5 40.2,91.98 J8.P$4
P8_01
  Top 0.254: U4.134 38.91,88.09 J8.P$3
P8_02
  Top 0.254: U4.135 37.6,88.69 37.6,92.04 J8.P$2
P8_03  (via drill 0.35)
  Top 0.254: v10.5,90 11.1,90 12.09,89.01 36.58,89.01 U4.136
  Bottom 0.254: v10.5,90 J14.2
P8_04  (via drill 0.35)
  Top 0.254: U4.137 57.68,67.19 57.68,67.2 36.28,88.6 v10.5,88.6
  Bottom 0.254: v10.5,88.6 10.42,88.68 6.32,88.68 J14.1
P8_05  (via drill 0.35)
  Top 0.254: v9.95,64.95 34.47,64.95 U4.173
  Bottom 0.254: v9.95,64.95 9.92,64.92 J11.6
P9_06  (via drill 0.35)
  Top 0.254: U4.72 78.09,38.3 v79.3,38.3
  Bottom 0.254: R10.P$2 78.6,39 v79.3,38.3 79.3,31.36 81.88,28.78 J9.9
P9_07  (via drill 0.35)
  Top 0.254: 71.19,44.48 71.05,44.62 U4.71 78.08,37.6 v78.5,37.6
  Bottom 0.254: R9.P$2 77.92,38.18 v78.5,37.6 78.74,37.36 78.74,30.49 79.34,29.89 J9.7
P9_08  (via drill 0.35)
  Top 0.254: U4.70 | U4.70 70.72,44.27 | U4.70 77.9,37.08 v77.9,36.9
  Bottom 0.254: R8.P$2 77.22,37.58 v77.9,36.9 78.01,36.79 78.01,30.61 76.8,29.4 J9.5
PA_00
  Top 0.254: U4.114 73.13,67.11 73.13,72.63 61.7,84.06 61.7,90.66 J8.P$21
PA_01
  Top 0.254: U4.113 73.55,66.82 73.55,72.88 63.1,83.33 63.1,91.94 J8.P$22
PA_08
  Top 0.254: U4.107 76.78,65.81 76.78,75.67 66.9,85.55 66.9,90.68 J8.P$25
PA_09
  Top 0.254: U4.108 76.37,66.11 76.37,75.43 65.6,86.2 65.6,91.98 J8.P$24
PA_10
  Top 0.254: U4.109 75.97,66.41 75.97,75.26 64.5,86.72 64.5,90.54 J8.P$23
R51
  Bottom 0.254: R23.P$1 31.59,6.16 U$2.12
R52
  Bottom 0.254: R24.P$1 18.44,6.22 U$2.9
RELAY_0  (via drill 0.35)
  Top 0.254: U4.59 73.3,33.9 85,33.9 86.67,35.57 86.67,45.09 88.1,46.52 88.1,50.5 88.34,50.74 88.34,54.31 88.84,54.82 88.84,60.14 v89.9,61.2
  Bottom 0.254: v89.9,61.2 RYS6.P$1
RELAY_1  (via drill 0.35)
  Top 0.254: U4.58 73.06,33.43 85.23,33.43 87.07,35.27 87.07,44.92 88.54,46.38 88.54,50.21 88.74,50.42 88.74,54.14 89.5,54.9 v89.5,57.3
  Bottom 0.254: v89.5,57.3 RZS3.P$1
RELAY_2  (via drill 0.35)
  Top 0.254: U4.57 72.76,33.03 85.45,33.03 87.48,35.05 87.48,44.75 88.94,46.22 88.94,50.04 89.4,50.5 v89.4,53.4
  Bottom 0.254: v89.4,53.4 RYS5.P$1
RELAY_3  (via drill 0.35)
  Top 0.254: U4.56 72.45,32.62 85.72,32.62 87.89,34.79 87.89,44.59 89.52,46.22 89.52,49.52 v89.6,49.6
  Bottom 0.254: v89.6,49.6 RXS3.P$1
RELAY_4  (via drill 0.35)
  Top 0.254: U4.55 72.15,32.21 85.91,32.21 88.29,34.59 88.29,40.42 89.3,41.43 v89.3,44.45
  Bottom 0.254: v89.3,44.45 RYS16.P$1
RELAY_5  (via drill 0.35)
  Top 0.254: U4.52 71.8,30.45 84.85,30.45 88.75,34.35 88.75,39.95 v89.35,40.55
  Bottom 0.254: v89.35,40.55 RZS8.P$1
RELAY_6  (via drill 0.35)
  Top 0.254: U4.51 | U4.51 71.54,30 85.1,30 89.5,34.4 v89.5,36.7
  Bottom 0.254: v89.5,36.7 93.5,36.7 RYS15.P$1
RELAY_7  (via drill 0.35)
  Top 0.254: v89,32.8 85.75,29.55 71.3,29.55 63.65,37.2 U4.50
  Bottom 0.254: RXS8.P$1 89.05,32.85 v89,32.8
RESET  (via drill 0.35)
  Top 0.254: 74.1,37.84 v74.11,37.85 74.21,37.75 74.21,36.87 R18.P$1 C57.P$1 73.24,39.61 U4.67
  Bottom 0.254: v74.11,37.85 88.14,51.88 88.14,75.39 92.79,80.04 J7.9
REXT
  Bottom 0.152: U3.9
  Bottom 0.254: U3.9 33.85,33.63 C47.P$1 33.83,33.67 R25.P$2
RXD0
  Bottom 0.254: U3.13 37.35,28.9 38.1,29.65 R31.P$2
RXD1
  Bottom 0.254: U3.12 35.35,30.8 35.75,31.2 36.4,31.2 R30.P$2
RXER
  Bottom 0.254: U3.17 37.75,26.9 38.85,25.8 R32.P$2
RXM
  Bottom 0.254: U$2.6 25.31,21.6 23.35,21.6 22.5,22.45 22.5,26.85 23.05,27.4 U3.3
RXP
  Bottom 0.254: U3.4 22.65,27.9 21.89,27.14 21.89,22.16 22.99,21.06 U$2.3
TCK  (via drill 0.35)
  Top 0.254: U4.88 77.06,51.26 v77.8,52
  Bottom 0.254: v77.8,52 78.8,53 83.3,53 87.7,57.4 87.7,77.03 93,82.33 J7.7
TDI  (via drill 0.35)
  Top 0.254: U4.91 77.94,55.65 78.42,55.65 v78.42,55.66
  Bottom 0.254: v78.42,55.66 86.34,63.58 86.34,83.53 93,90.18 J7.1
TDO  (via drill 0.35)
  Top 0.254: U4.90 77.98,54.98 v79.11,54.98
  Bottom 0.254: v79.11,54.98 84.08,54.98 86.8,57.7 86.8,81.4 93,87.6 J7.3
TMS  (via drill 0.35)
  Top 0.254: U4.89 77.86,54.16 v78.67,54.16
  Bottom 0.254: v78.67,54.16 78.72,54.21 83.91,54.21 87.25,57.55 87.25,79.37 J7.5
TXM
  Bottom 0.254: U3.5 20.75,28.4 19.4,27.05 19.4,21 20.3,20.1 U$2.2
TXP
  Bottom 0.254: U3.6 20.35,28.9 18.7,27.25 18.7,19.31 U$2.1
USB_N
  Top 0.254: U4.46 63.8,34.2 R5.P$1
USB_P
  Top 0.254: R6.P$1 65.1,12.95 64.25,13.8 64.25,34.46 U4.47
USB_VBUS_B
  Top 0.254: R4.P$1 62.4,12.9 63.3,13.8 63.3,29.27 58.5,34.07 58.5,34.8 U4.44
USBHS_FAULT  (via drill 0.35)
  Top 0.254: U2.3 45.4,20.89 R12.P$1 v46.32,22.3 | v61.7,22.3 v53.6,22.3 | v75.7,45.2 75.43,45.2 U4.78
  Bottom 0.254: 61.66,22.3 v61.7,22.3 61.4,22.6 61.4,29.5 66.1,34.2 66.1,35.3 75.7,44.9 v75.7,45.2 | v53.6,22.3 v46.32,22.3
USBHS_N
  Top 0.254: J3.D- 47.7,16.7 48.4,17.4 48.4,30.5 53.3,35.4 53.3,38.79 U4.31
USBHS_P
  Top 0.254: J3.D+ 49.7,16.7 48.9,17.5 48.9,30.43 53.71,35.23 53.71,38.49 U4.32
USBHS_VBUS  (via drill 0.35)
  Top 0.254: U2.5 47.35,17.86 45.2,15.71 | 45.2,15.71 45.2,16.2 C11.P$1 43.6,16.4 43.6,18.7 C15.1 | 45.2,15.71 J3.VBUS | v44.55,41.8 45.95,43.2 47.81,43.2 U4.17
  Top 0.508: U2.5 47.4,18.3 | v43.5,15 43.5,16.3 43.6,16.4
  Bottom 0.254: v43.5,15 43.5,39.37 44.55,40.66 v44.55,41.8
USBHS_VBUSEN
  Top 0.254: R1.P$1 47.4,22.8 47.4,20.89 U2.1
VBUS
  Top 0.4: J5.P$1 63.1,7.5 | 63.1,7.5 63.1,8.5 | R4.P$2 62.4,9.38 63.1,8.68 63.1,8.5 | R7.P$2 63.1,7.5 | C16.P$1 63.1,8.5
VCL_F(FLASH)  (via drill 0.35)
  Top 0.254: U4.112 71.12,63.69 71.39,63.69 v71.9,64.2
  Bottom 0.254: v71.9,64.2 71.9,64.31 C36.P$2
VDD  (via drill 0.35)  (3 unrouted)
  Top 0.254: 32.95,20.65 32.95,24.25 29.92,27.28 R26.P$2 R27.P$2 | U4.61 69.03,39.58 v69.03,39.27 v69.04,39.26 69.04,38.78 72.86,34.96 | v75.4,57.6 75.4,57.35 U4.97 | U4.110 70.95,62.1 v70.95,62.35 | U4.123 66.3,66.64 v66.3,67.1 | U4.138 56.17,68 v55.9,68 | U4.149 52.8,63.59 v52.4,63.59 | U4.155 50.35,61.8 v50.1,61.8 | U4.171 45,55.83 v45,56.3 | U4.25 51.6,41.33 v51.6,40.9 | U4.26 51.88,40.9 v51.6,40.9 | U4.34 54.9,38.27 v54.9,37.9 | U4.48 64.94,34.48 v64.94,34.06 64.94,34.01 C61.P$2 | R18.P$2 73.1,35.86 | R20.P$1 39.85,96.95 v40.5,97.6 41.13,96.97 R21.P$1 | v76.72,47.88 76.72,48.15 U4.84 | 73.1,35.88 R18.P$2 | 72.86,34.96 73.88,34.96 C59.P$1 | R18.P$2 73.15,35.25 72.94,35.04 | v51.6,40.9 51.6,40.8 C58.P$1 | 72.86,34.96 72.94,35.04 | 72.94,35.04 v73.08,35.04 | R14.P$1 R11.P$1
  Top 0.508: v77,12.2 C34.P$1 C35.P$1 C33.P$1 77,7.44 R13.P$2 | v24,22.65 30.95,22.65 32.95,20.65 v35.03,18.57 | R11.P$1 8.7,55.6 v6.4,55.6
  Bottom 0.152: U3.14 36.09,28.38
  Bottom 0.254: R23.P$2 31.59,3.49 31.6,3.65 | U3.14 37.75,28.4 39.95,30.6 C49.P$1 | 77.45,56.45 76.55,56.45 v75.4,57.6 76.74,58.94 C13.P$2 | 51.68,64.31 C56.P$2 51.57,64.42 v52.4,63.59 | 44.89,56.3 C30.P$2 | C60.P$1 54.98,37.82 v54.9,37.9 | v76.72,47.88 77.61,48.76 C32.P$1 | R10.P$1 77.75,39.9 R9.P$1 76.43,38.57 R8.P$1 R3.P$1 75.68,37.82 R2.P$1 73.08,35.23 v73.08,35.04 | v50.1,61.8 49.99,61.8 C55.P$2 | v55.9,68 55.84,68 C54.P$2 | v70.95,62.35 71.45,62.35 73.19,64.09 C10.P$2 | v66.3,67.1 67,67.8 C14.P$2
  Bottom 0.508: v35.03,18.57 35.03,3.68 33.8,2.45 31.5,2.45 | v24,22.65 23.92,22.73 FB2/2.1 | 31.5,2.45 19.02,2.45 R24.P$2 | 31.5,2.45 31.5,3.4 31.59,3.49 | v35.03,18.57 35.24,18.57 41.6,24.93 41.6,30 C48.1 41,30.6 C49.P$1 39.58,30.6 39.2,30.98 39.2,34.3 38.68,34.82 R28.P$2 R29.P$2 | v77,12.2 74.21,9.41 61.49,9.41 57.93,12.97 40.63,12.97 v35.03,18.57 | 60.5,58.9 67.5,58.9 v70.95,62.35 | 57.09,58.9 60.5,58.9 | 60.5,50.5 50.8,50.5 v45,56.3 | 60.5,46.4 57.1,46.4 v51.6,40.9 | 60.51,35.31 60.5,35.3 | 60.5,58.9 60.6,59 60.6,63.57 | 60.6,63.57 62.77,63.57 v66.3,67.1 | v69.03,39.27 67.7,40.6 60.5,40.6 57.51,40.6 54.9,37.99 v54.9,37.9 | v52.4,63.59 57.09,58.9 | v50.1,61.8 53,58.9 57.09,58.9 | v55.9,68 60.33,63.57 60.6,63.57 | v64.94,34.06 61.8,37.2 60.5,37.2 | 91.88,91.98 87.95,95.9 42.2,95.9 v40.5,97.6 13.7,97.6 7.8,91.7 3.9,91.7 2.5,90.3 2.5,59.5 v6.4,55.6
  Bottom 1.016: 76.4,12.8 65,12.8 60.5,17.3 60.5,35.3 60.5,37.2 60.5,40.6 60.5,46.4 60.5,50.5 | 60.5,58.9 60.5,50.5 | 74.1,50.5 75.5,51.9 75.5,54.5 77.45,56.45 85.5,64.5 85.5,85.6 91.88,91.98 94.9,91.98 95.54,91.34 J7.2 J7.4 | 60.5,50.5 74.1,50.5 | v76.72,47.88 74.1,50.5
  Bottom 1.27: L3.2 74.9,7.6 77,9.7 v77,12.2 76.4,12.8
VDD5  (via drill 0.35)
  Top 0.254: R1.P$2 45,23.5 44.2,22.7 R12.P$2 44.15,22.25 C5.P$1 C8.P$1 v40.8,22.25
  Top 0.508: 45.41,18.4 U2.4 44.71,19.1 44.71,20.32 44.2,20.82 R12.P$2 | v73.4,11.2 75.24,13.04 v79.4,13.04
  Bottom 0.508: v40.8,22.25 42.1,20.95 42.1,14.75 43.1,13.75 58.73,13.75 60.88,11.2 v73.4,11.2 | J6.5 J6.6 85.38,10.98 85.4,11 85.4,11.7 84.06,13.04 v79.4,13.04
VDD12  (1 unrouted)
VDD_1.2
  Bottom 0.254: U3.1 30.32,26.4 C46.P$1 C45.P$1
VDD_ENET1
  Bottom 0.254: C44.P$1 27.79,26.41 | 26.36,25.81 C43.1 26.53,26.18 C44.P$1 | C44.P$1 27.79,26.59 28.09,26.9 U3.2
  Bottom 0.508: 26.22,25.95 C43.1 24.05,25.91 FB2/2.2
VDDIN
  Bottom 1.27: J6.3 J6.4 82.84,8.06 81.8,9.1 79.4,9.1 77.1,6.8 L3.1
XCIN  (1 unrouted)
  Top 0.2: 43.95,40.51 43.74,40.29
  Top 0.254: U4.20 47.55,40.82 C50.P$1 46.57,40.08 X3.P$1
XCOUT  (2 unrouted)
  Top 0.254: 46.8,39.39 47.31,39.87 U4.21 | C51.P$1 46.02,38.31 X3.P$2
XII
  Bottom 0.254: U3.8 33.35,31.4 32.94,31.81 26.12,31.81 24.92,33.01 C42.P$1 24.92,32.71 24.66,32.45 22.11,32.45 U$3.1
XOO
  Bottom 0.254: U3.7 32.85,30.82 32.38,31.29 25.27,31.29 C41.P$1 24.87,31.58 24.55,31.9 19.95,31.9 19.65,31.61 U$3.3
XTAL1  (1 unrouted)
  Top 0.152: 47.09,34.53 X4.1
  Top 0.254: U4.23 49.5,40.65 49.5,38.74 49.96,38.28 49.96,37.32 C52.P$1 50,35.9 48.63,34.53 47.09,34.53
XTAL2  (2 unrouted)
  Top 0.2: 50.06,34.25 X4.3
  Top 0.254: X4.3 51.19,35.38 C53.P$1 51.19,37.04 50.37,37.87 50.37,38.45 49.91,38.91 49.91,40.35 U4.24

### Text on the board
tNames: 2 | 40 | 1 | 2 | 1 | TDI | VDD | 39 | TDO | VDD | TMS | GND | TCK | GND | RESET | GND | 9 | 10 | 3 | 2 | 1 | ##### | 0 | 0 | ##### | 1 | 3 | ##### | 2 | 2 | 3 | 1 | ##### | 0 | 0 | Limit Switches | 3 | 1 | 2 | 2 | 1 | 3 | 0